# EAGLE design SpecialistEE20 (EAGLE 6.4)

## Sheet 1 of 5
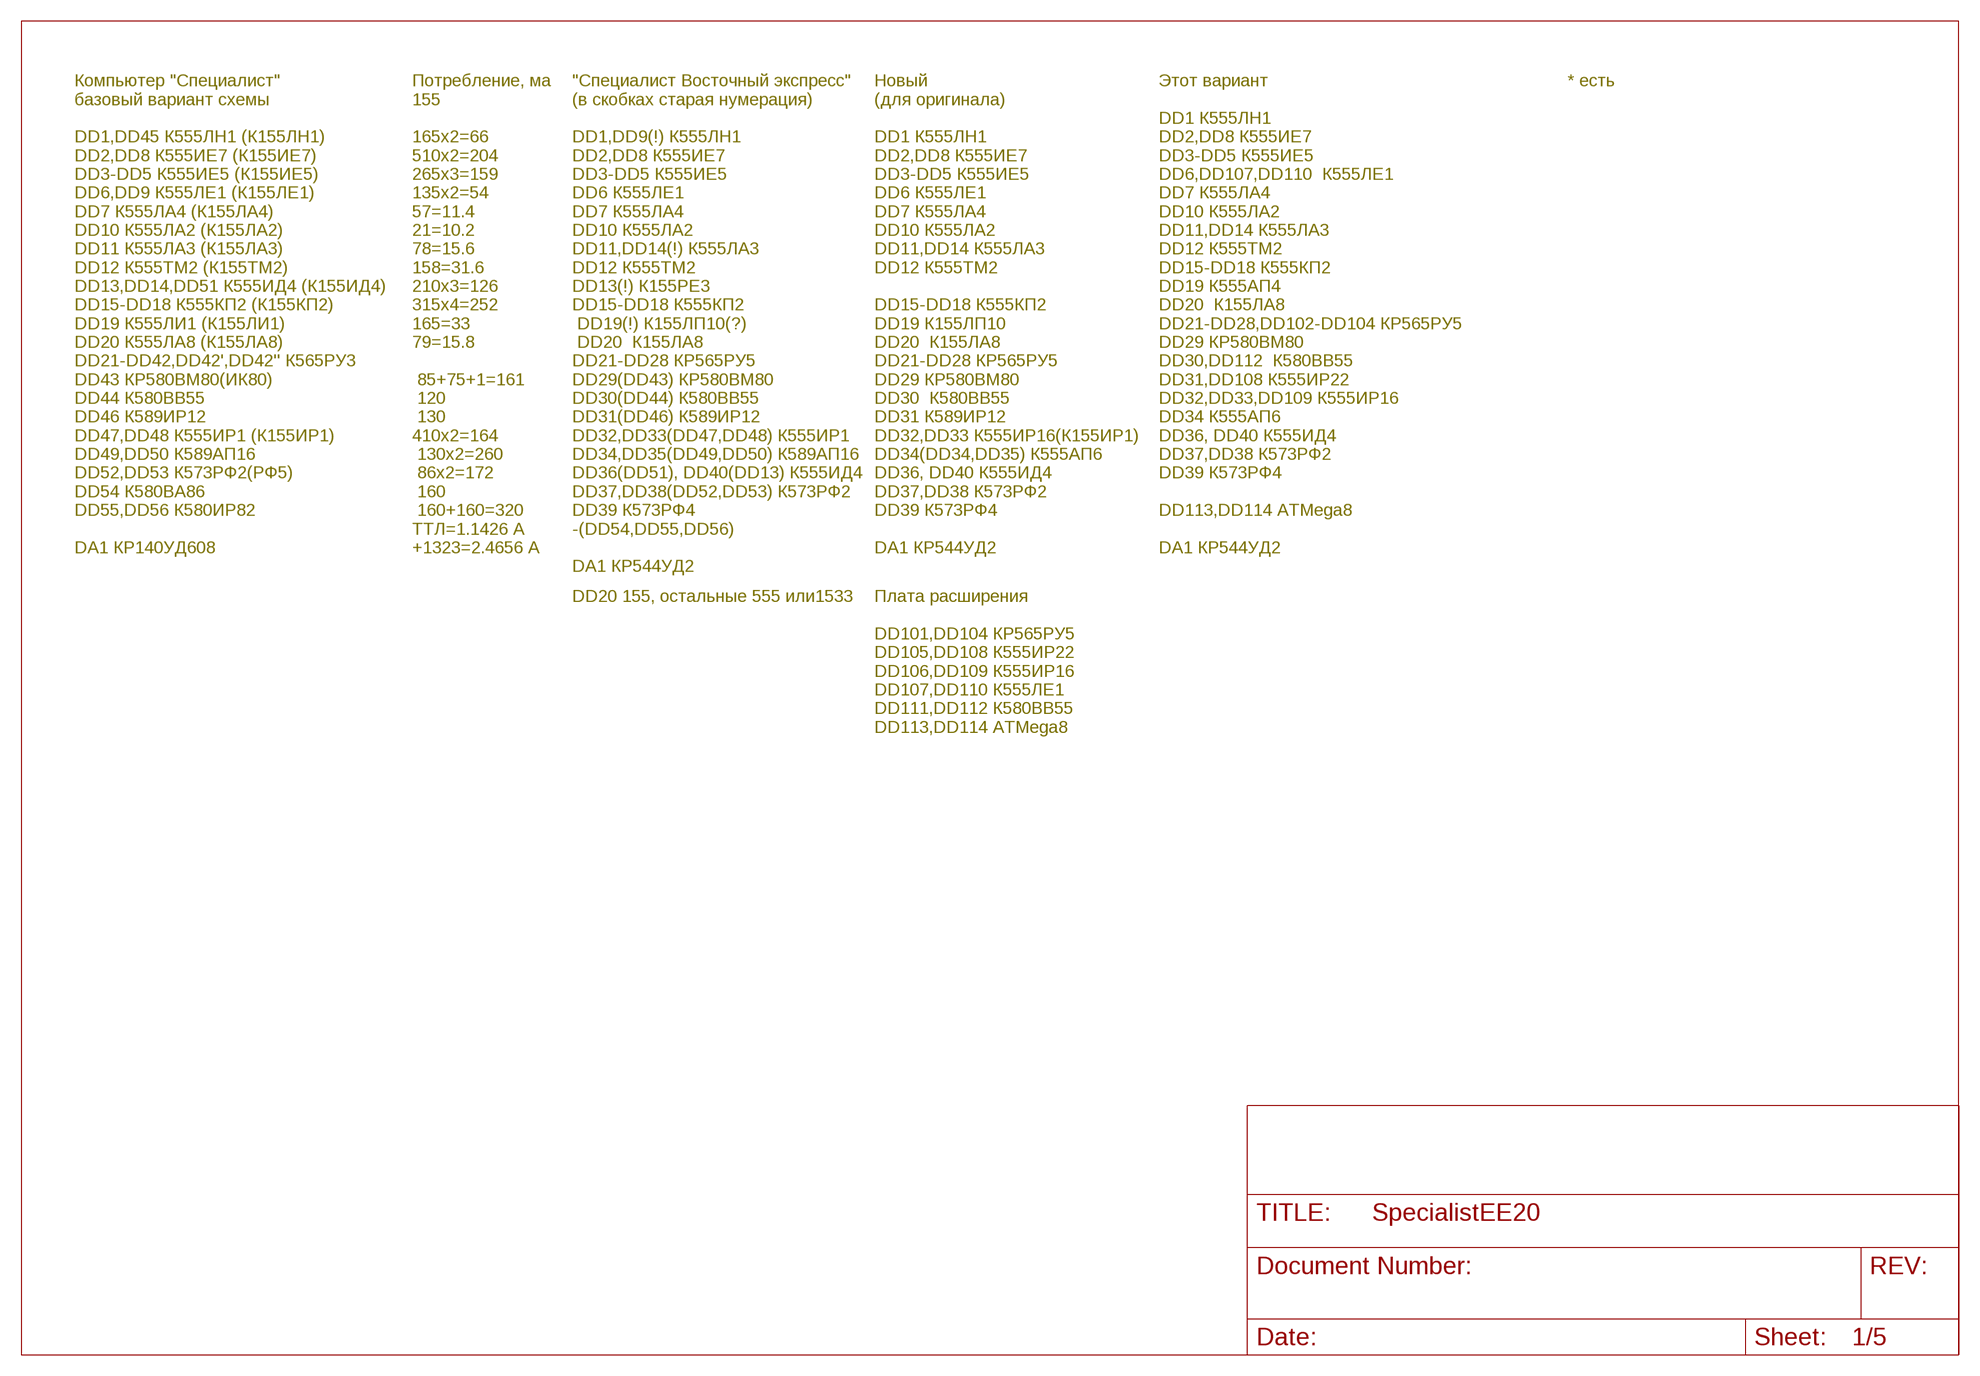
[diagram p0: schematic, sheet 1]

### Notes on the sheet
- Компьютер "Специалист"
  базовый вариант схемы
  
  DD1,DD45 К555ЛН1 (К155ЛН1)
  DD2,DD8 К555ИЕ7 (К155ИЕ7)
  DD3-DD5 К555ИЕ5 (К155ИЕ5)
  DD6,DD9 К555ЛЕ1 (К155ЛЕ1)
  DD7 К555ЛА4 (К155ЛА4)
  DD10 К555ЛА2 (К155ЛА2)
  DD11 К555ЛА3 (К155ЛА3)
  DD12 К555ТМ2 (К155ТМ2)
  DD13,DD14,DD51 К555ИД4 (К155ИД4)
  DD15-DD18 К555КП2 (К155КП2)
  DD19 К555ЛИ1 (К155ЛИ1)
  DD20 К555ЛА8 (К155ЛА8)
  DD21-DD42,DD42',DD42'' К565РУ3
  DD43 КР580ВМ80(ИК80)
  DD44 К580ВВ55
  DD46 К589ИР12
  DD47,DD48 К555ИР1 (К155ИР1)
  DD49,DD50 К589АП16
  DD52,DD53 К573РФ2(РФ5)
  DD54 К580ВА86
  DD55,DD56 К580ИР82
  
  DA1 КР140УД608
- Потребление, ма
  155 
  
  165х2=66
  510х2=204
  265х3=159
  135х2=54
  57=11.4
  21=10.2
  78=15.6
  158=31.6
  210х3=126
  315х4=252
  165=33
  79=15.8
  
   85+75+1=161
   120
   130
  410х2=164
   130х2=260
   86х2=172
   160
   160+160=320
  ТТЛ=1.1426 А
  +1323=2.4656 А
- "Специалист Восточный экспресс"
  (в скобках старая нумерация)
  
  DD1,DD9(!) К555ЛН1
  DD2,DD8 К555ИЕ7
  DD3-DD5 К555ИЕ5
  DD6 К555ЛЕ1
  DD7 К555ЛА4
  DD10 К555ЛА2
  DD11,DD14(!) К555ЛА3
  DD12 К555ТМ2
  DD13(!) К155РЕ3
  DD15-DD18 К555КП2
   DD19(!) К155ЛП10(?)
   DD20  К155ЛА8
  DD21-DD28 КР565РУ5
  DD29(DD43) КР580ВМ80
  DD30(DD44) К580ВВ55
  DD31(DD46) К589ИР12
  DD32,DD33(DD47,DD48) К555ИР1
  DD34,DD35(DD49,DD50) К589АП16
  DD36(DD51), DD40(DD13) К555ИД4 
  DD37,DD38(DD52,DD53) К573РФ2
  DD39 К573РФ4
  -(DD54,DD55,DD56)
  
  DA1 КР544УД2
- Новый
  (для оригинала)
  
  DD1 К555ЛН1
  DD2,DD8 К555ИЕ7
  DD3-DD5 К555ИЕ5
  DD6 К555ЛЕ1
  DD7 К555ЛА4
  DD10 К555ЛА2
  DD11,DD14 К555ЛА3
  DD12 К555ТМ2
  
  DD15-DD18 К555КП2
  DD19 К155ЛП10
  DD20  К155ЛА8
  DD21-DD28 КР565РУ5
  DD29 КР580ВМ80
  DD30  К580ВВ55
  DD31 К589ИР12
  DD32,DD33 К555ИР16(К155ИР1)
  DD34(DD34,DD35) К555АП6
  DD36, DD40 К555ИД4 
  DD37,DD38 К573РФ2
  DD39 К573РФ4
  
  DA1 КР544УД2
- Этот вариант
  
  DD1 К555ЛН1
  DD2,DD8 К555ИЕ7
  DD3-DD5 К555ИЕ5
  DD6,DD107,DD110  К555ЛЕ1
  DD7 К555ЛА4
  DD10 К555ЛА2
  DD11,DD14 К555ЛА3
  DD12 К555ТМ2
  DD15-DD18 К555КП2
  DD19 К555АП4
  DD20  К155ЛА8
  DD21-DD28,DD102-DD104 КР565РУ5
  DD29 КР580ВМ80
  DD30,DD112  К580ВВ55
  DD31,DD108 К555ИР22
  DD32,DD33,DD109 К555ИР16
  DD34 К555АП6
  DD36, DD40 К555ИД4 
  DD37,DD38 К573РФ2
  DD39 К573РФ4
  
  DD113,DD114 ATMega8
  
  DA1 КР544УД2
- * есть
- DD20 155, остальные 555 или1533
- Плата расширения
  
  DD101,DD104 КР565РУ5
  DD105,DD108 К555ИР22
  DD106,DD109 К555ИР16
  DD107,DD110 К555ЛЕ1
  DD111,DD112 К580ВВ55
  DD113,DD114 ATMega8

## Sheet 2 of 5
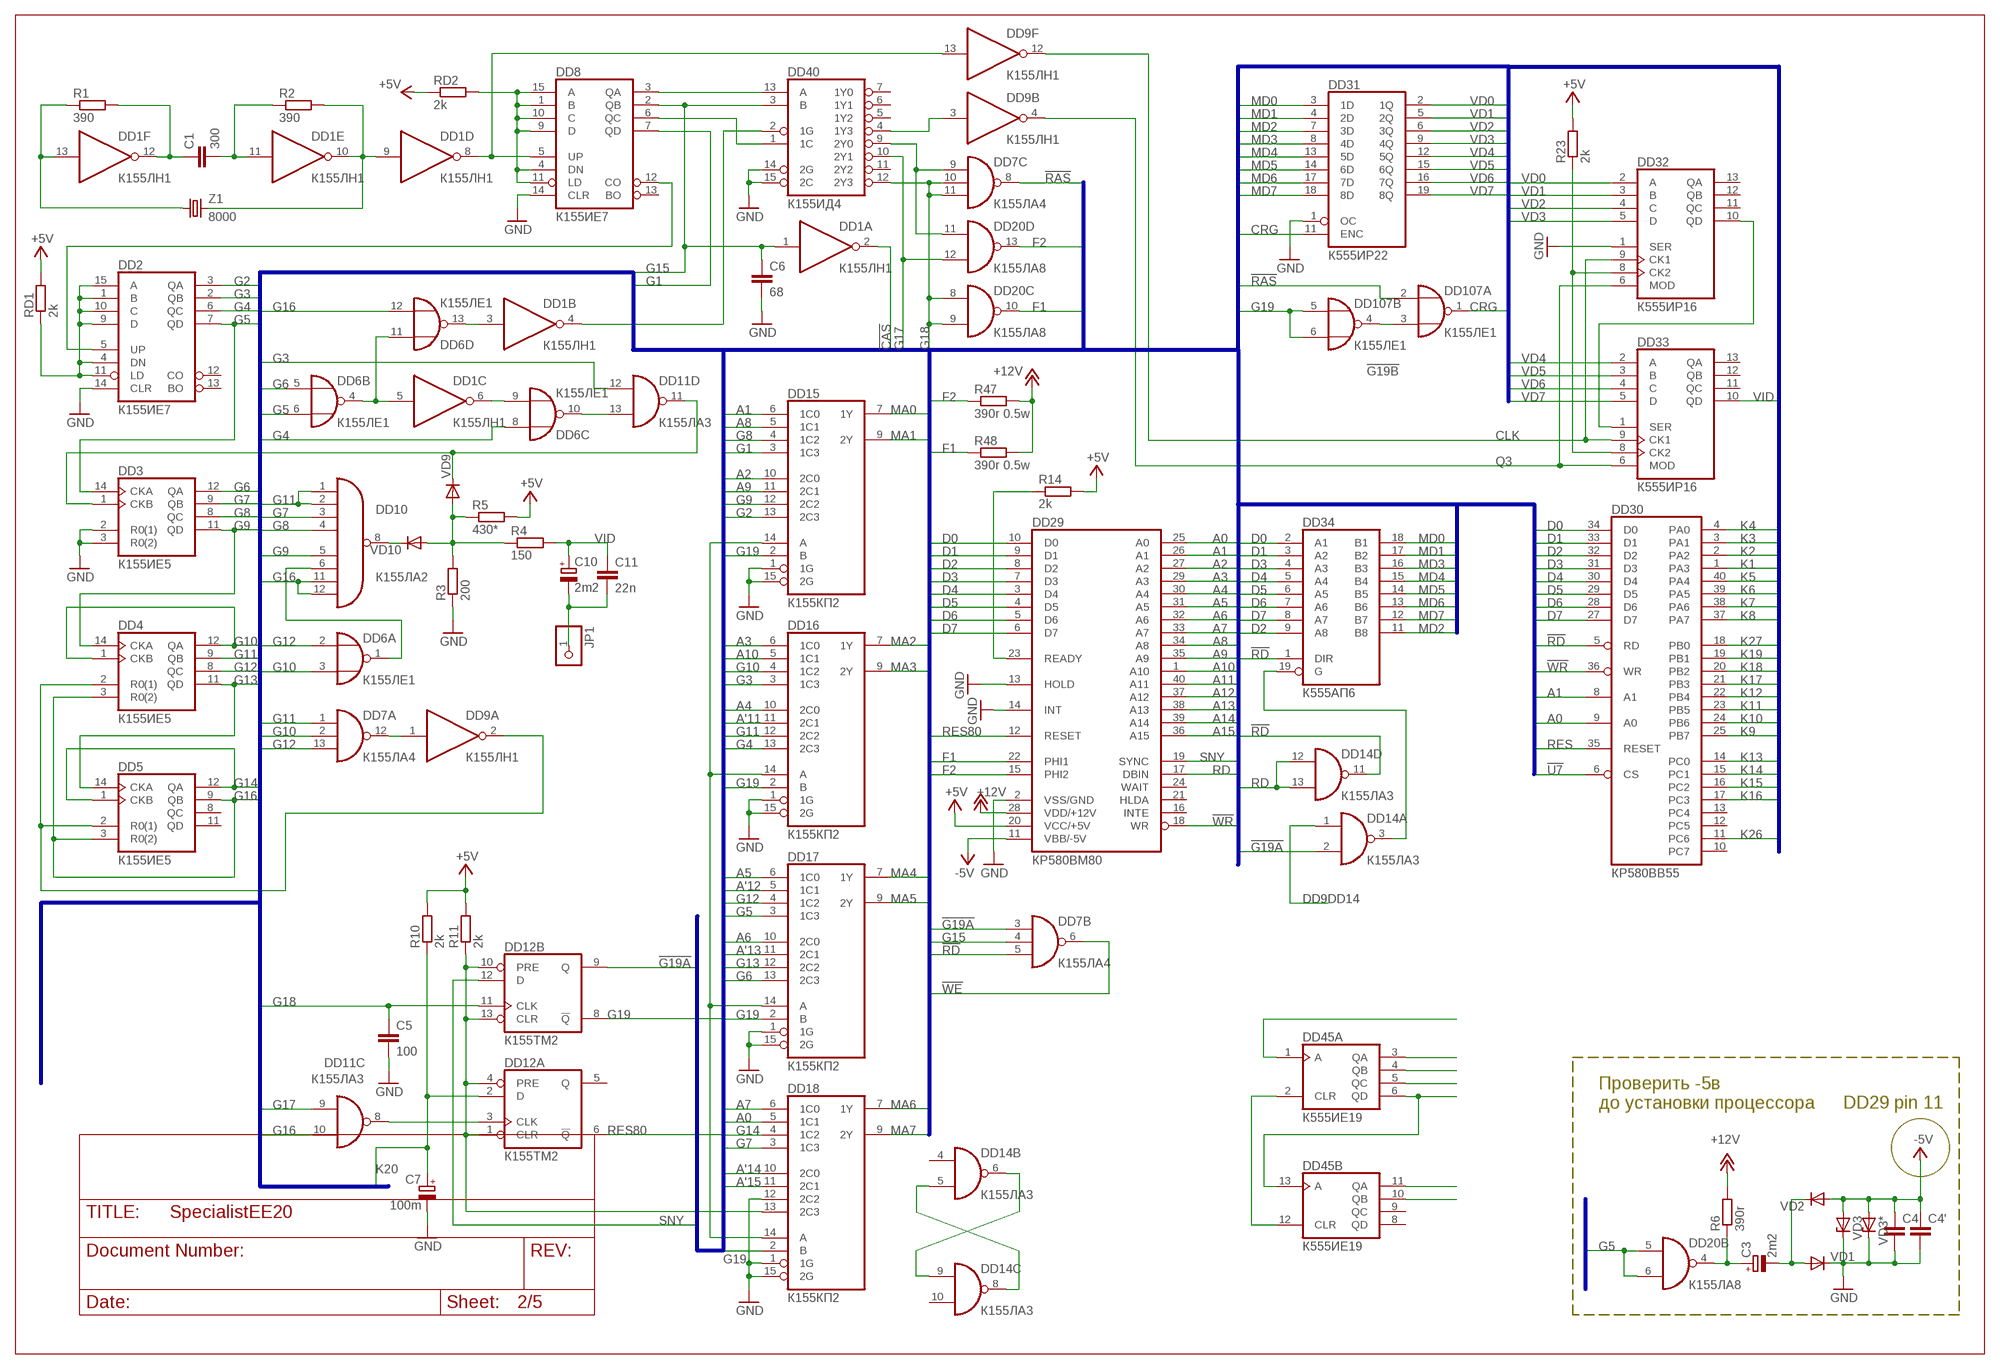
[diagram p1: schematic, sheet 2]

### Parts
C1  300  C-EUC0805  [C0805]
C3  2m2  CPOL-EUE2.5-5  [E2,5-5]
C4  C-EUC1206  [C1206]
C4'  C-EUC1206  [C1206]
C5  100  C-EUC0805  [C0805]
C6  68  C-EUC0805  [C0805]
C7  100m  CPOL-EUE2.5-5  [E2,5-5]
C10  2m2  CPOL-EUE2.5-5  [E2,5-5]
C11  22n  C-EUC0805  [C0805]
DD1  К155ЛН1  7404N  [DIL14]
DD2  К155ИЕ7  74192N  [DIL16]
DD3  К155ИЕ5  74LS93N  [DIL14]
DD4  К155ИЕ5  74LS93N  [DIL14]
DD5  К155ИЕ5  74LS93N  [DIL14]
DD6  К155ЛЕ1  7402N  [DIL14]
DD7  К155ЛА4  7410N  [DIL14]
DD8  К155ИЕ7  74192N  [DIL16]
DD9  К155ЛН1  7404N  [DIL14]
DD10  К155ЛА2  7430N  [DIL14]
DD11  К155ЛА3  7400N  [DIL14]
DD12  К155ТМ2  74S74N  [DIL14]
DD14  К155ЛА3  7400N  [DIL14]
DD15  К155КП2  74S153N  [DIL16]
DD16  К155КП2  74S153N  [DIL16]
DD17  К155КП2  74S153N  [DIL16]
DD18  К155КП2  74S153N  [DIL16]
DD20  К155ЛА8  74LS01N  [DIL14]
DD29  КР580ВМ80  8080  [DIL40]
DD30  КР580ВВ55  8255A  [DIL40]
DD31  К555ИР22  74LS373N  [DIL20]
DD32  К555ИР16  7495N  [DIL14]
DD33  К555ИР16  7495N  [DIL14]
DD34  К555АП6  74LS245N  [DIL20]
DD40  К155ИД4  74LS155N  [DIL16]
DD45  К555ИЕ19  74393N  [DIL14]
DD107  К155ЛЕ1  7402N  [DIL14]
JP1  PINHD-1X1  [1X01]
R1  390  R-EU_M1206  [M1206]
R2  390  R-EU_M1206  [M1206]
R3  200  R-EU_M1206  [M1206]
R4  150  R-EU_M1206  [M1206]
R5  430*  R-EU_M1206  [M1206]
R6  390r  R-EU_0411/15  [0411/15]
R10  2k  R-EU_M1206  [M1206]
R11  2k  R-EU_M1206  [M1206]
R14  2k  R-EU_M1206  [M1206]
R23  2k  R-EU_M1206  [M1206]
R47  390r 0.5w  R-EU_0411/15  [0411/15]
R48  390r 0.5w  R-EU_0411/15  [0411/15]
RD1  2k  R-EU_M1206  [M1206]
RD2  2k  R-EU_M1206  [M1206]
VD1  DIODE-SOD80C  [SOD80C]
VD2  DIODE-SOD80C  [SOD80C]
VD3  ZENER-DIODESOD80C  [SOD80C]
VD3*  ZENER-DIODESOD80C  [SOD80C]
VD9  DIODE-SOD80C  [SOD80C]
VD10  DIODE-SOD80C  [SOD80C]
Z1  8000  CRYSTALHC49S  [HC49/S]

### Nets
!CAS: DD1.2(A:O) ; also sheet 3,4
!G19A: DD7.3(B:I0) DD12.9(B:Q) DD14.2(A:I1)
!G19B: DD107.3(A:I1) DD107.4(B:O)
!RAS: DD7.8(C:O) DD107.2(A:I0) ; also sheet 3,4
!RD: DD7.5(B:I2) DD14.11(D:O) DD30.5(RD) DD34.1(DIR) ; also sheet 5
!U7: DD30.6(CS) ; also sheet 5
!WE: DD7.6(B:O) ; also sheet 3,4
!WR: DD29.18(WR) DD30.36(WR) ; also sheet 5
+5V: DD29.20(VCC/+5V) R5.2 R10.2 R11.2 R14.2 R23.2 RD1.2 RD2.1 ; also sheet 3,4,5
+12V: DD29.28(VDD/+12V) R6.2 R47.2 R48.2 ; also sheet 3
-5V: C4'.1 C4.1 DD29.11(VBB/-5V) VD2.A VD3*.A VD3.A
A0: DD18.5(1C1) DD29.25(A0) DD30.9(A0) ; also sheet 5
A1: DD15.6(1C0) DD29.26(A1) DD30.8(A1) ; also sheet 5
A2: DD15.10(2C0) DD29.27(A2)
A3: DD16.6(1C0) DD29.29(A3)
A4: DD16.10(2C0) DD29.30(A4)
A5: DD17.6(1C0) DD29.31(A5)
A6: DD17.10(2C0) DD29.32(A6)
A7: DD18.6(1C0) DD29.33(A7)
A8: DD15.5(1C1) DD29.34(A8)
A9: DD15.11(2C1) DD29.35(A9)
A10: DD16.5(1C1) DD29.1(A10)
A11: DD29.40(A11) ; also sheet 3
A12: DD29.37(A12) ; also sheet 3
A13: DD29.38(A13) ; also sheet 3
A14: DD29.39(A14) ; also sheet 3
A15: DD29.36(A15) ; also sheet 3
A'11: DD16.11(2C1)
A'12: DD17.5(1C1)
A'13: DD17.11(2C1)
A'14: DD18.10(2C0)
A'15: DD18.11(2C1)
CLK: DD9.12(F:O) DD32.9(CK1) DD33.9(CK1) ; also sheet 4
CRG: DD31.11(ENC) DD107.1(A:O) ; also sheet 4
D0: DD29.10(D0) DD30.34(D0) DD34.2(A1) ; also sheet 5
D1: DD29.9(D1) DD30.33(D1) DD34.3(A2) ; also sheet 5
D2: DD29.8(D2) DD30.32(D2) DD34.9(A8) ; also sheet 5
D3: DD29.7(D3) DD30.31(D3) DD34.4(A3) ; also sheet 5
D4: DD29.3(D4) DD30.30(D4) DD34.5(A4) ; also sheet 5
D5: DD29.4(D5) DD30.29(D5) DD34.6(A5) ; also sheet 5
D6: DD29.5(D6) DD30.28(D6) DD34.7(A6) ; also sheet 5
D7: DD29.6(D7) DD30.27(D7) DD34.8(A7) ; also sheet 5
DD9DD14: DD14.1(A:I0) ; also sheet 3
F1: DD20.10(C:O) DD29.22(PHI1) R48.1
F2: DD20.13(D:O) DD29.15(PHI2) R47.1
G1: DD8.7(QD) DD15.3(1C3)
G2: DD2.3(QA) DD15.13(2C3)
G3: DD2.2(QB) DD11.12(D:I0) DD16.3(1C3)
G4: DD2.6(QC) DD6.8(C:I0) DD16.13(2C3)
G5: DD2.7(QD) DD3.14(CKA) DD6.6(B:I1) DD17.3(1C3) DD20.5(B:I0) DD20.6(B:I1)
G6: DD3.12(QA) DD6.5(B:I0) DD17.13(2C3)
G7: DD3.9(QB) DD10.3(I2) DD18.3(1C3)
G8: DD3.8(QC) DD10.4(I3) DD15.4(1C2)
G9: DD3.11(QD) DD4.14(CKA) DD10.5(I4) DD15.12(2C2)
G10: DD4.1(CKB) DD4.12(QA) DD6.3(A:I1) DD7.2(A:I1) DD16.4(1C2)
G11: DD4.9(QB) DD7.1(A:I0) DD10.1(I0) DD10.2(I1) DD16.12(2C2)
G12: DD4.8(QC) DD6.2(A:I0) DD7.13(A:I2) DD17.4(1C2)
G13: DD4.11(QD) DD5.14(CKA) DD17.12(2C2)
G14: DD5.1(CKB) DD5.12(QA) DD18.4(1C2)
G15: C6.1 DD1.1(A:I) DD7.4(B:I1) DD8.2(QB) DD40.3(B)
G16: DD4.3(R0(2)) DD5.3(R0(2)) DD5.9(QB) DD6.12(D:I1) DD10.11(I6) DD10.12(I7) DD11.10(C:I1)
G17: DD11.9(C:I0) DD20.12(D:I1) DD40.10(2Y1)
G18: C5.1 DD7.10(C:I1) DD7.11(C:I2) DD12.11(B:CLK) DD20.8(C:I0) DD20.9(C:I1) DD40.12(2Y3)
G19: DD12.8(B:!Q) DD15.2(B) DD16.2(B) DD17.2(B) DD18.2(B) DD107.5(B:I0) DD107.6(B:I1)
GND: C4'.2 C4.2 C5.2 C6.2 C7.- DD2.14(CLR) DD3.2(R0(1)) DD3.3(R0(2)) DD8.14(CLR) DD15.1(1G) DD15.15(2G) DD16.1(1G) DD16.15(2G) DD17.1(1G) DD17.15(2G) DD18.1(1G) DD18.12(2C2) DD18.15(2G) DD29.2(VSS/GND) DD29.13(HOLD) DD29.14(INT) DD31.1(OC) DD32.1(SER) DD40.14(2G) DD40.15(2C) R3.1 VD1.C VD3*.C VD3.C ; also sheet 3,4,5
K1: DD30.1(PA3) ; also sheet 5
K2: DD30.2(PA2) ; also sheet 5
K3: DD30.3(PA1) ; also sheet 5
K4: DD30.4(PA0) ; also sheet 5
K5: DD30.40(PA4) ; also sheet 5
K6: DD30.39(PA5) ; also sheet 5
K7: DD30.38(PA6) ; also sheet 5
K8: DD30.37(PA7) ; also sheet 5
K9: DD30.25(PB7) ; also sheet 5
K10: DD30.24(PB6) ; also sheet 5
K11: DD30.23(PB5) ; also sheet 5
K12: DD30.22(PB4) ; also sheet 5
K13: DD30.14(PC0) ; also sheet 5
K14: DD30.15(PC1) ; also sheet 5
K15: DD30.16(PC2) ; also sheet 5
K16: DD30.17(PC3) ; also sheet 5
K17: DD30.21(PB3) ; also sheet 5
K18: DD30.20(PB2) ; also sheet 5
K19: DD30.19(PB1) ; also sheet 5
K20: C7.+ DD12.2(A:D) R10.1
K26: DD30.11(PC6)
K27: DD30.18(PB0) ; also sheet 5
MA0: DD15.7(1Y) ; also sheet 3,4
MA1: DD15.9(2Y) ; also sheet 3,4
MA2: DD16.7(1Y) ; also sheet 3,4
MA3: DD16.9(2Y) ; also sheet 3,4
MA4: DD17.7(1Y) ; also sheet 3,4
MA5: DD17.9(2Y) ; also sheet 3,4
MA6: DD18.7(1Y) ; also sheet 3,4
MA7: DD18.9(2Y) ; also sheet 3,4
MD0: DD31.3(1D) DD34.18(B1) ; also sheet 3
MD1: DD31.4(2D) DD34.17(B2) ; also sheet 3
MD2: DD31.7(3D) DD34.11(B8) ; also sheet 3
MD3: DD31.8(4D) DD34.16(B3) ; also sheet 3
MD4: DD31.13(5D) DD34.15(B4) ; also sheet 3
MD5: DD31.14(6D) DD34.14(B5) ; also sheet 3
MD6: DD31.17(7D) DD34.13(B6) ; also sheet 3
MD7: DD31.18(8D) DD34.12(B7) ; also sheet 3
N$1: DD6.10(C:O) DD11.13(D:I1)
N$2: DD1.5(C:I) DD6.4(B:O) DD6.11(D:I0)
N$3: DD1.13(F:I) R1.1 Z1.1
N$4: DD9.3(B:I) DD40.4(1Y3)
N$5: C1.1 DD1.12(F:O) R1.2
N$6: DD1.9(D:I) DD1.10(E:O) R2.2 Z1.2
N$7: C1.2 DD1.11(E:I) R2.1
N$8: DD1.8(D:O) DD8.5(UP) DD9.13(F:I)
N$11: DD2.5(UP) DD8.12(CO)
N$12: DD6.1(A:O) DD10.6(I5)
N$13: DD1.6(C:O) DD6.9(C:I1)
N$14: DD1.3(B:I) DD6.13(D:O)
N$16: DD4.2(R0(1)) DD5.2(R0(1)) DD9.2(A:O)
N$19: DD7.9(C:I0) DD20.11(D:I0) DD40.9(2Y0)
N$20: DD8.3(QA) DD40.13(A)
N$21: C3.+ DD20.4(B:O) R6.1
N$22: C3.- VD1.A VD2.C
N$23: DD8.6(QC) DD40.1(1C)
N$24: DD1.4(B:O) DD40.2(1G)
N$25: DD10.8(O) VD10.C
N$26: DD3.1(CKB) DD11.11(D:O) VD9.C
N$27: R3.2 R4.1 R5.1 VD9.A VD10.A
N$28: DD32.10(QD) DD33.1(SER)
N$29: DD2.1(B) DD2.4(DN) DD2.9(D) DD2.10(C) DD2.11(LD) DD2.15(A) RD1.1
N$30: DD45.3(A:QA)
N$31: DD12.1(A:CLR) DD12.4(A:PRE) DD12.10(B:PRE) DD12.13(B:CLR) DD18.13(2C3) R11.1
N$32: DD45.6(A:QD) DD45.13(B:A)
N$33: C10.- C11.2 JP1.1
N$34: DD11.8(C:O) DD12.3(A:CLK)
N$36: DD14.5(B:I1) DD14.8(C:O)
N$37: DD7.12(A:O) DD9.1(A:I)
N$38: DD8.1(B) DD8.4(DN) DD8.9(D) DD8.10(C) DD8.11(LD) DD8.15(A) RD2.2
N$41: DD15.14(A) DD16.14(A) DD17.14(A) DD18.14(A)
N$47: DD45.4(A:QB)
N$49: DD32.8(CK2) DD33.8(CK2) R23.1
N$57: DD14.6(B:O) DD14.9(C:I0)
N$61: DD45.5(A:QC)
N$62: DD45.11(B:QA)
N$63: DD45.10(B:QB)
N$64: DD45.1(A:A)
N$65: DD45.2(A:CLR) DD45.12(B:CLR)
N$66: DD29.23(READY) R14.1
N$69: DD14.3(A:O) DD34.19(G)
Q3: DD9.4(B:O) DD32.6(MOD) DD33.6(MOD) ; also sheet 4
RD: DD14.12(D:I0) DD14.13(D:I1) DD29.17(DBIN)
RES: DD30.35(RESET) ; also sheet 5
RES80: DD12.6(A:!Q) DD29.12(RESET)
SNY: DD12.12(B:D) DD29.19(SYNC)
VD0: DD31.2(1Q) DD32.2(A)
VD1: DD31.5(2Q) DD32.3(B)
VD2: DD31.6(3Q) DD32.4(C)
VD3: DD31.9(4Q) DD32.5(D)
VD4: DD31.12(5Q) DD33.2(A)
VD5: DD31.15(6Q) DD33.3(B)
VD6: DD31.16(7Q) DD33.4(C)
VD7: DD31.19(8Q) DD33.5(D)
VID: C10.+ C11.1 DD33.10(QD) R4.2 ; also sheet 4
Unconnected: DD2.12(CO) DD2.13(BO) DD5.8(QC) DD5.11(QD) DD8.13(BO) DD9.8(D:O) DD9.9(D:I) DD9.10(E:O) DD9.11(E:I) DD11.4(B:I0) DD11.5(B:I1) DD11.6(B:O) DD12.5(A:Q) DD14.4(B:I0) DD14.10(C:I1) DD29.16(INTE) DD29.21(HLDA) DD29.24(WAIT) DD30.10(PC7) DD30.12(PC5) DD30.13(PC4) DD32.11(QC) DD32.12(QB) DD32.13(QA) DD33.11(QC) DD33.12(QB) DD33.13(QA) DD40.5(1Y2) DD40.6(1Y1) DD40.7(1Y0) DD40.11(2Y2) DD45.8(B:QD) DD45.9(B:QC)

### Buses
A[0..15],A'[11..15],D[0..7],F[1..2],G[1..19],!G19A,MA[0..7],MD[0..7],VD[0..11],K[1..27],!RAS,!CAS,CLK,!WE,!WR,X-----X,U7,!U[6..7],!RESIN,RES,RES80,RD,!RD,SNY,STRT,B,G,R,B0,G0,R0,SND,VID,LED,P[1..24],R[1..2],CRG,CS,!R,SH,TON,Q3,MOSI,MISO,SCK

### Notes on the sheet
- Проверить -5в 
  до установки процессора
- DD29 pin 11

## Sheet 3 of 5
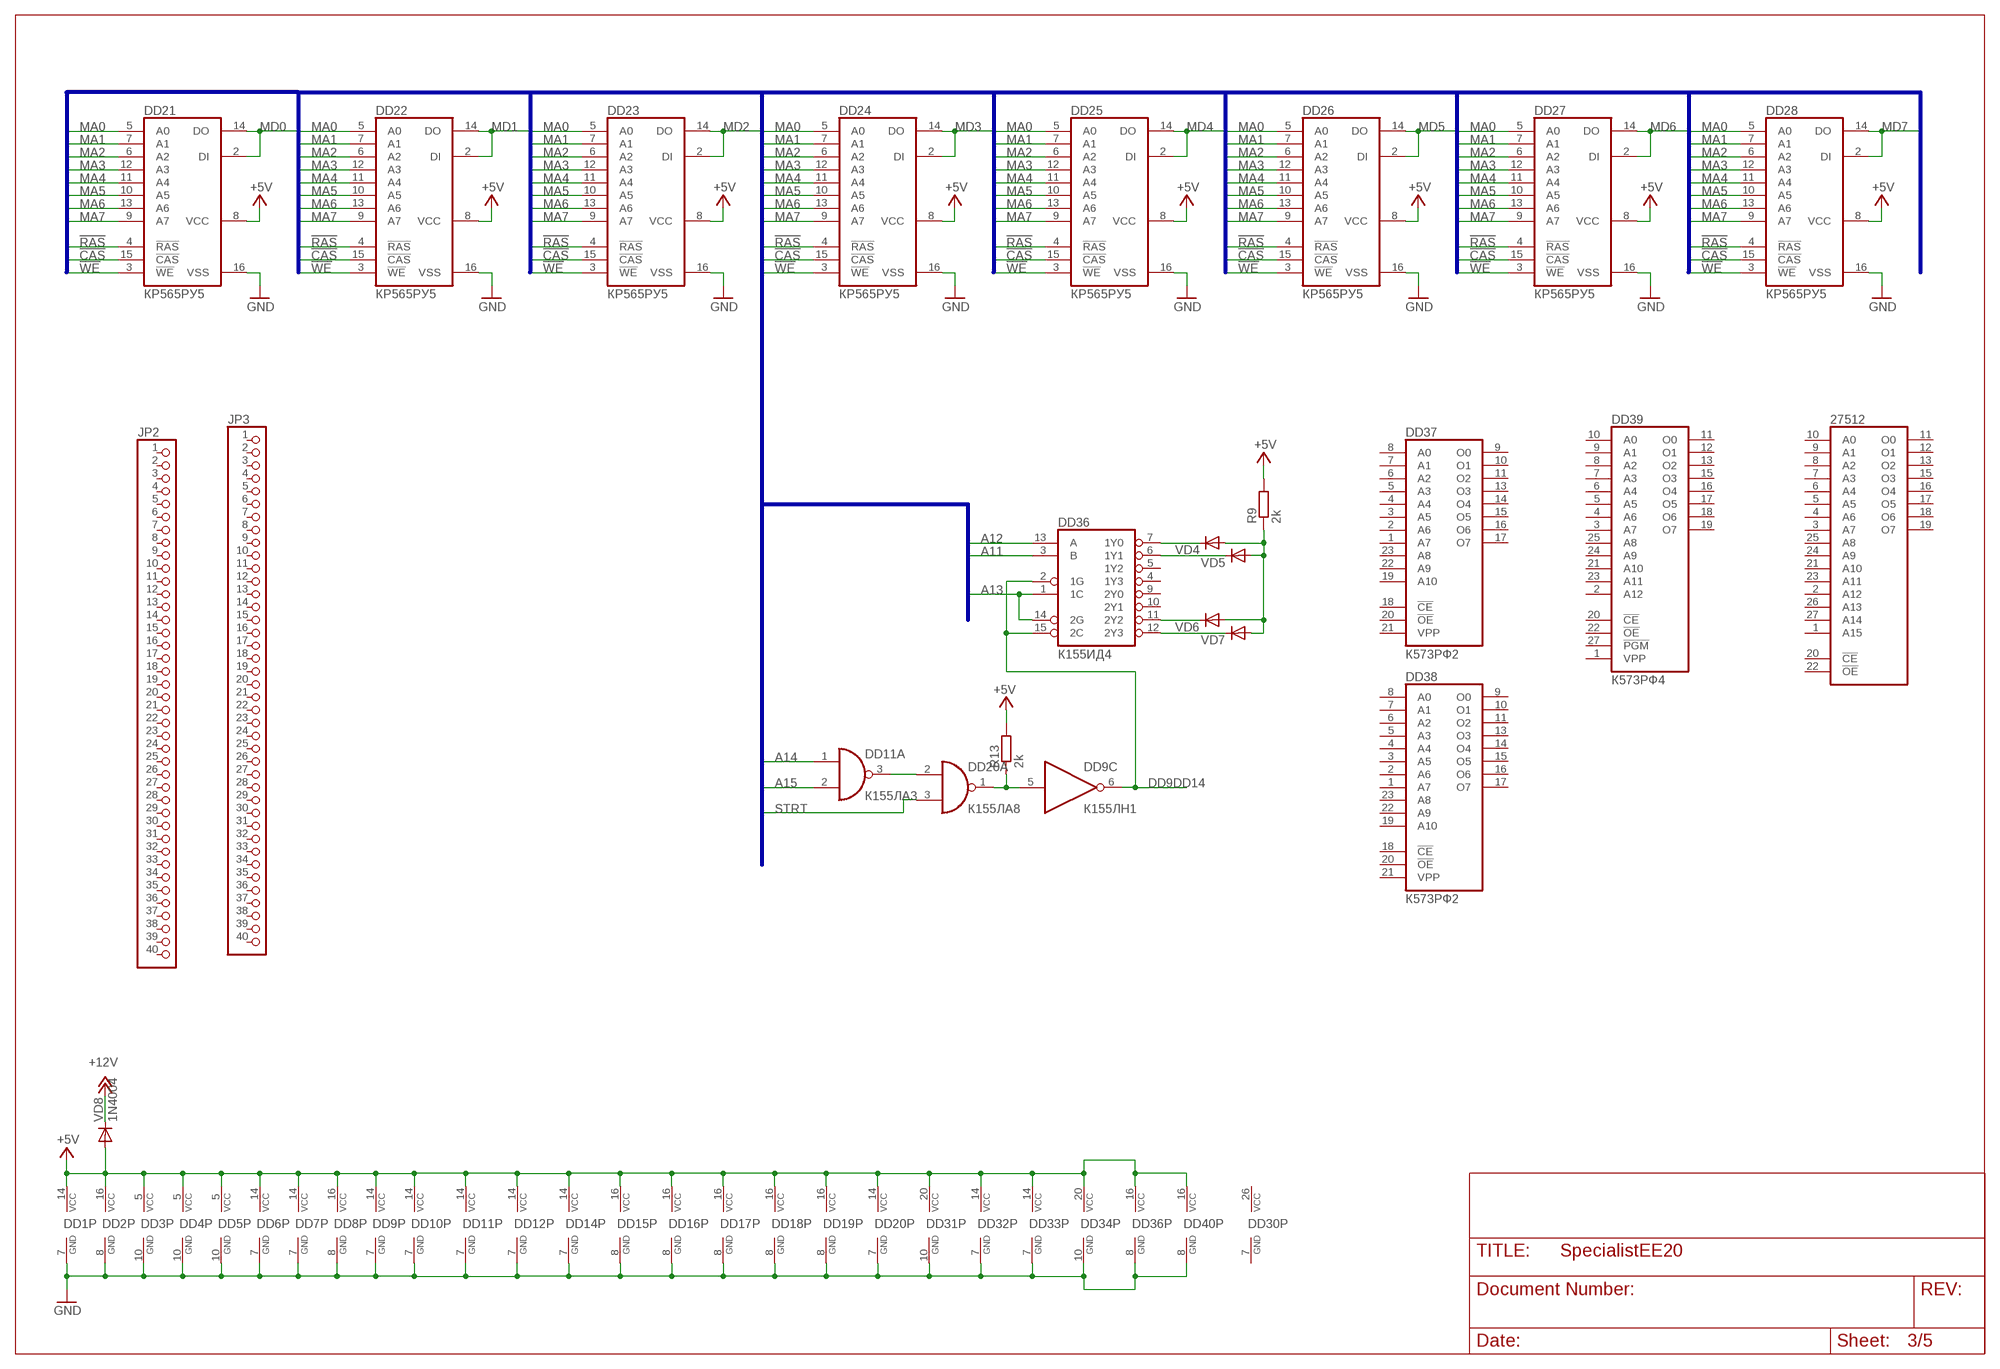
[diagram p2: schematic, sheet 3]

### Parts
27512  27512  [DIL28]
DD19  К155ЛП10  74LS365N  [DIL16]
DD21  КР565РУ5  2164  [DIL16]
DD22  КР565РУ5  2164  [DIL16]
DD23  КР565РУ5  2164  [DIL16]
DD24  КР565РУ5  2164  [DIL16]
DD25  КР565РУ5  2164  [DIL16]
DD26  КР565РУ5  2164  [DIL16]
DD27  КР565РУ5  2164  [DIL16]
DD28  КР565РУ5  2164  [DIL16]
DD36  К155ИД4  74LS155N  [DIL16]
DD37  К573РФ2  2716  [DIL24]
DD38  К573РФ2  2716  [DIL24]
DD39  К573РФ4  2764  [DIL28]
JP2  PINHD-1X40  [1X40]
JP3  PINHD-1X40  [1X40]
R9  2k  R-EU_M1206  [M1206]
R13  2k  R-EU_M1206  [M1206]
VD4  DIODE-SOD80C  [SOD80C]
VD5  DIODE-SOD80C  [SOD80C]
VD6  DIODE-SOD80C  [SOD80C]
VD7  DIODE-SOD80C  [SOD80C]
VD8  1N4004  [DO41-10]

### Nets
!CAS: DD21.15(!CAS) DD22.15(!CAS) DD23.15(!CAS) DD24.15(!CAS) DD25.15(!CAS) DD26.15(!CAS) DD27.15(!CAS) DD28.15(!CAS) ; also sheet 2,4
!RAS: DD21.4(!RAS) DD22.4(!RAS) DD23.4(!RAS) DD24.4(!RAS) DD25.4(!RAS) DD26.4(!RAS) DD27.4(!RAS) DD28.4(!RAS) ; also sheet 2,4
!WE: DD21.3(!WE) DD22.3(!WE) DD23.3(!WE) DD24.3(!WE) DD25.3(!WE) DD26.3(!WE) DD27.3(!WE) DD28.3(!WE) ; also sheet 2,4
+5V: DD1.14(P:VCC) DD2.16(VCC) DD3.5(VCC) DD4.5(VCC) DD5.5(VCC) DD6.14(P:VCC) DD7.14(P:VCC) DD8.16(VCC) DD9.14(P:VCC) DD10.14(VCC) DD11.14(P:VCC) DD12.14(P:VCC) DD14.14(P:VCC) DD15.16(VCC) DD16.16(VCC) DD17.16(VCC) DD18.16(VCC) DD19.16(VCC) DD20.14(P:VCC) DD21.8(VCC) DD22.8(VCC) DD23.8(VCC) DD24.8(VCC) DD25.8(VCC) DD26.8(VCC) DD27.8(VCC) DD28.8(VCC) DD31.20(VCC) DD32.14(VCC) DD33.14(VCC) DD34.20(VCC) DD36.16(VCC) DD40.16(VCC) R9.2 R13.2 VD8.A ; also sheet 2,4,5
+12V: VD8.C ; also sheet 2
A11: DD36.3(B) ; also sheet 2
A12: DD36.13(A) ; also sheet 2
A13: DD36.1(1C) DD36.14(2G) ; also sheet 2
A14: DD11.1(A:I0) ; also sheet 2
A15: DD11.2(A:I1) ; also sheet 2
DD9DD14: DD9.6(C:O) DD36.2(1G) DD36.15(2C) ; also sheet 2
GND: DD1.7(P:GND) DD2.8(GND) DD3.10(GND) DD4.10(GND) DD5.10(GND) DD6.7(P:GND) DD7.7(P:GND) DD8.8(GND) DD9.7(P:GND) DD10.7(GND) DD11.7(P:GND) DD12.7(P:GND) DD14.7(P:GND) DD15.8(GND) DD16.8(GND) DD17.8(GND) DD18.8(GND) DD19.8(GND) DD20.7(P:GND) DD21.16(VSS) DD22.16(VSS) DD23.16(VSS) DD24.16(VSS) DD25.16(VSS) DD26.16(VSS) DD27.16(VSS) DD28.16(VSS) DD31.10(GND) DD32.7(GND) DD33.7(GND) DD34.10(GND) DD36.8(GND) DD40.8(GND) ; also sheet 2,4,5
MA0: DD21.5(A0) DD22.5(A0) DD23.5(A0) DD24.5(A0) DD25.5(A0) DD26.5(A0) DD27.5(A0) DD28.5(A0) ; also sheet 2,4
MA1: DD21.7(A1) DD22.7(A1) DD23.7(A1) DD24.7(A1) DD25.7(A1) DD26.7(A1) DD27.7(A1) DD28.7(A1) ; also sheet 2,4
MA2: DD21.6(A2) DD22.6(A2) DD23.6(A2) DD24.6(A2) DD25.6(A2) DD26.6(A2) DD27.6(A2) DD28.6(A2) ; also sheet 2,4
MA3: DD21.12(A3) DD22.12(A3) DD23.12(A3) DD24.12(A3) DD25.12(A3) DD26.12(A3) DD27.12(A3) DD28.12(A3) ; also sheet 2,4
MA4: DD21.11(A4) DD22.11(A4) DD23.11(A4) DD24.11(A4) DD25.11(A4) DD26.11(A4) DD27.11(A4) DD28.11(A4) ; also sheet 2,4
MA5: DD21.10(A5) DD22.10(A5) DD23.10(A5) DD24.10(A5) DD25.10(A5) DD26.10(A5) DD27.10(A5) DD28.10(A5) ; also sheet 2,4
MA6: DD21.13(A6) DD22.13(A6) DD23.13(A6) DD24.13(A6) DD25.13(A6) DD26.13(A6) DD27.13(A6) DD28.13(A6) ; also sheet 2,4
MA7: DD21.9(A7) DD22.9(A7) DD23.9(A7) DD24.9(A7) DD25.9(A7) DD26.9(A7) DD27.9(A7) DD28.9(A7) ; also sheet 2,4
MD0: DD21.2(DI) DD21.14(DO) ; also sheet 2
MD1: DD22.2(DI) DD22.14(DO) ; also sheet 2
MD2: DD23.2(DI) DD23.14(DO) ; also sheet 2
MD3: DD24.2(DI) DD24.14(DO) ; also sheet 2
MD4: DD25.2(DI) DD25.14(DO) ; also sheet 2
MD5: DD26.2(DI) DD26.14(DO) ; also sheet 2
MD6: DD27.2(DI) DD27.14(DO) ; also sheet 2
MD7: DD28.2(DI) DD28.14(DO) ; also sheet 2
N$9: DD36.7(1Y0) VD4.C
N$10: DD36.6(1Y1) VD5.C
N$15: DD36.11(2Y2) VD6.C
N$17: DD36.12(2Y3) VD7.C
N$18: R9.1 VD4.A VD5.A VD6.A VD7.A
N$44: DD11.3(A:O) DD20.2(A:I0)
N$53: DD9.5(C:I) DD20.1(A:O) R13.1
STRT: DD20.3(A:I1)
Unconnected: 27512.1(A15) 27512.2(A12) 27512.3(A7) 27512.4(A6) 27512.5(A5) 27512.6(A4) 27512.7(A3) 27512.8(A2) 27512.9(A1) 27512.10(A0) 27512.11(O0) 27512.12(O1) 27512.13(O2) 27512.15(O3) 27512.16(O4) 27512.17(O5) 27512.18(O6) 27512.19(O7) 27512.20(!CE) 27512.21(A10) 27512.22(!OE) 27512.23(A11) 27512.24(A9) 27512.25(A8) 27512.26(A13) 27512.27(A14) DD19.1(G1) DD19.2(A1) DD19.3(Y1) DD19.4(A2) DD19.5(Y2) DD19.6(A3) DD19.7(Y3) DD19.9(Y4) DD19.10(A4) DD19.11(Y5) DD19.12(A5) DD19.13(Y6) DD19.14(A6) DD19.15(G2) DD36.4(1Y3) DD36.5(1Y2) DD36.9(2Y0) DD36.10(2Y1) DD37.1(A7) DD37.2(A6) DD37.3(A5) DD37.4(A4) DD37.5(A3) DD37.6(A2) DD37.7(A1) DD37.8(A0) DD37.9(O0) DD37.10(O1) DD37.11(O2) DD37.13(O3) DD37.14(O4) DD37.15(O5) DD37.16(O6) DD37.17(O7) DD37.18(!CE) DD37.19(A10) DD37.20(!OE) DD37.21(VPP) DD37.22(A9) DD37.23(A8) DD38.1(A7) DD38.2(A6) DD38.3(A5) DD38.4(A4) DD38.5(A3) DD38.6(A2) DD38.7(A1) DD38.8(A0) DD38.9(O0) DD38.10(O1) DD38.11(O2) DD38.13(O3) DD38.14(O4) DD38.15(O5) DD38.16(O6) DD38.17(O7) DD38.18(!CE) DD38.19(A10) DD38.20(!OE) DD38.21(VPP) DD38.22(A9) DD38.23(A8) DD39.1(VPP) DD39.2(A12) DD39.3(A7) DD39.4(A6) DD39.5(A5) DD39.6(A4) DD39.7(A3) DD39.8(A2) DD39.9(A1) DD39.10(A0) DD39.11(O0) DD39.12(O1) DD39.13(O2) DD39.15(O3) DD39.16(O4) DD39.17(O5) DD39.18(O6) DD39.19(O7) DD39.20(!CE) DD39.21(A10) DD39.22(!OE) DD39.23(A11) DD39.24(A9) DD39.25(A8) DD39.27(!PGM) JP2.1 JP2.2 JP2.3 JP2.4 JP2.5 JP2.6 JP2.7 JP2.8 JP2.9 JP2.10 JP2.11 JP2.12 JP2.13 JP2.14 JP2.15 JP2.16 JP2.17 JP2.18 JP2.19 JP2.20 JP2.21 JP2.22 JP2.23 JP2.24 JP2.25 JP2.26 JP2.27 JP2.28 JP2.29 JP2.30 JP2.31 JP2.32 JP2.33 JP2.34 JP2.35 JP2.36 JP2.37 JP2.38 JP2.39 JP2.40 JP3.1 JP3.2 JP3.3 JP3.4 JP3.5 JP3.6 JP3.7 JP3.8 JP3.9 JP3.10 JP3.11 JP3.12 JP3.13 JP3.14 JP3.15 JP3.16 JP3.17 JP3.18 JP3.19 JP3.20 JP3.21 JP3.22 JP3.23 JP3.24 JP3.25 JP3.26 JP3.27 JP3.28 JP3.29 JP3.30 JP3.31 JP3.32 JP3.33 JP3.34 JP3.35 JP3.36 JP3.37 JP3.38 JP3.39 JP3.40

### Buses
A[0..15],A'[11..15],D[0..7],F[1..2],G[1..19],!G19A,MA[0..7],MD[0..7],VD[0..11],K[1..27],!RAS,!CAS,CLK,!WE,!WR,X-----X,U7,!U[6..7],!RESIN,RES,RES80,RD,!RD,SNY,STRT,B,G,R,B0,G0,R0,SND,VID,LED,P[1..24],R[1..2],CRG,CS,!R,SH,TON,Q3,MOSI,MISO,SCK

## Sheet 4 of 5: VCOL
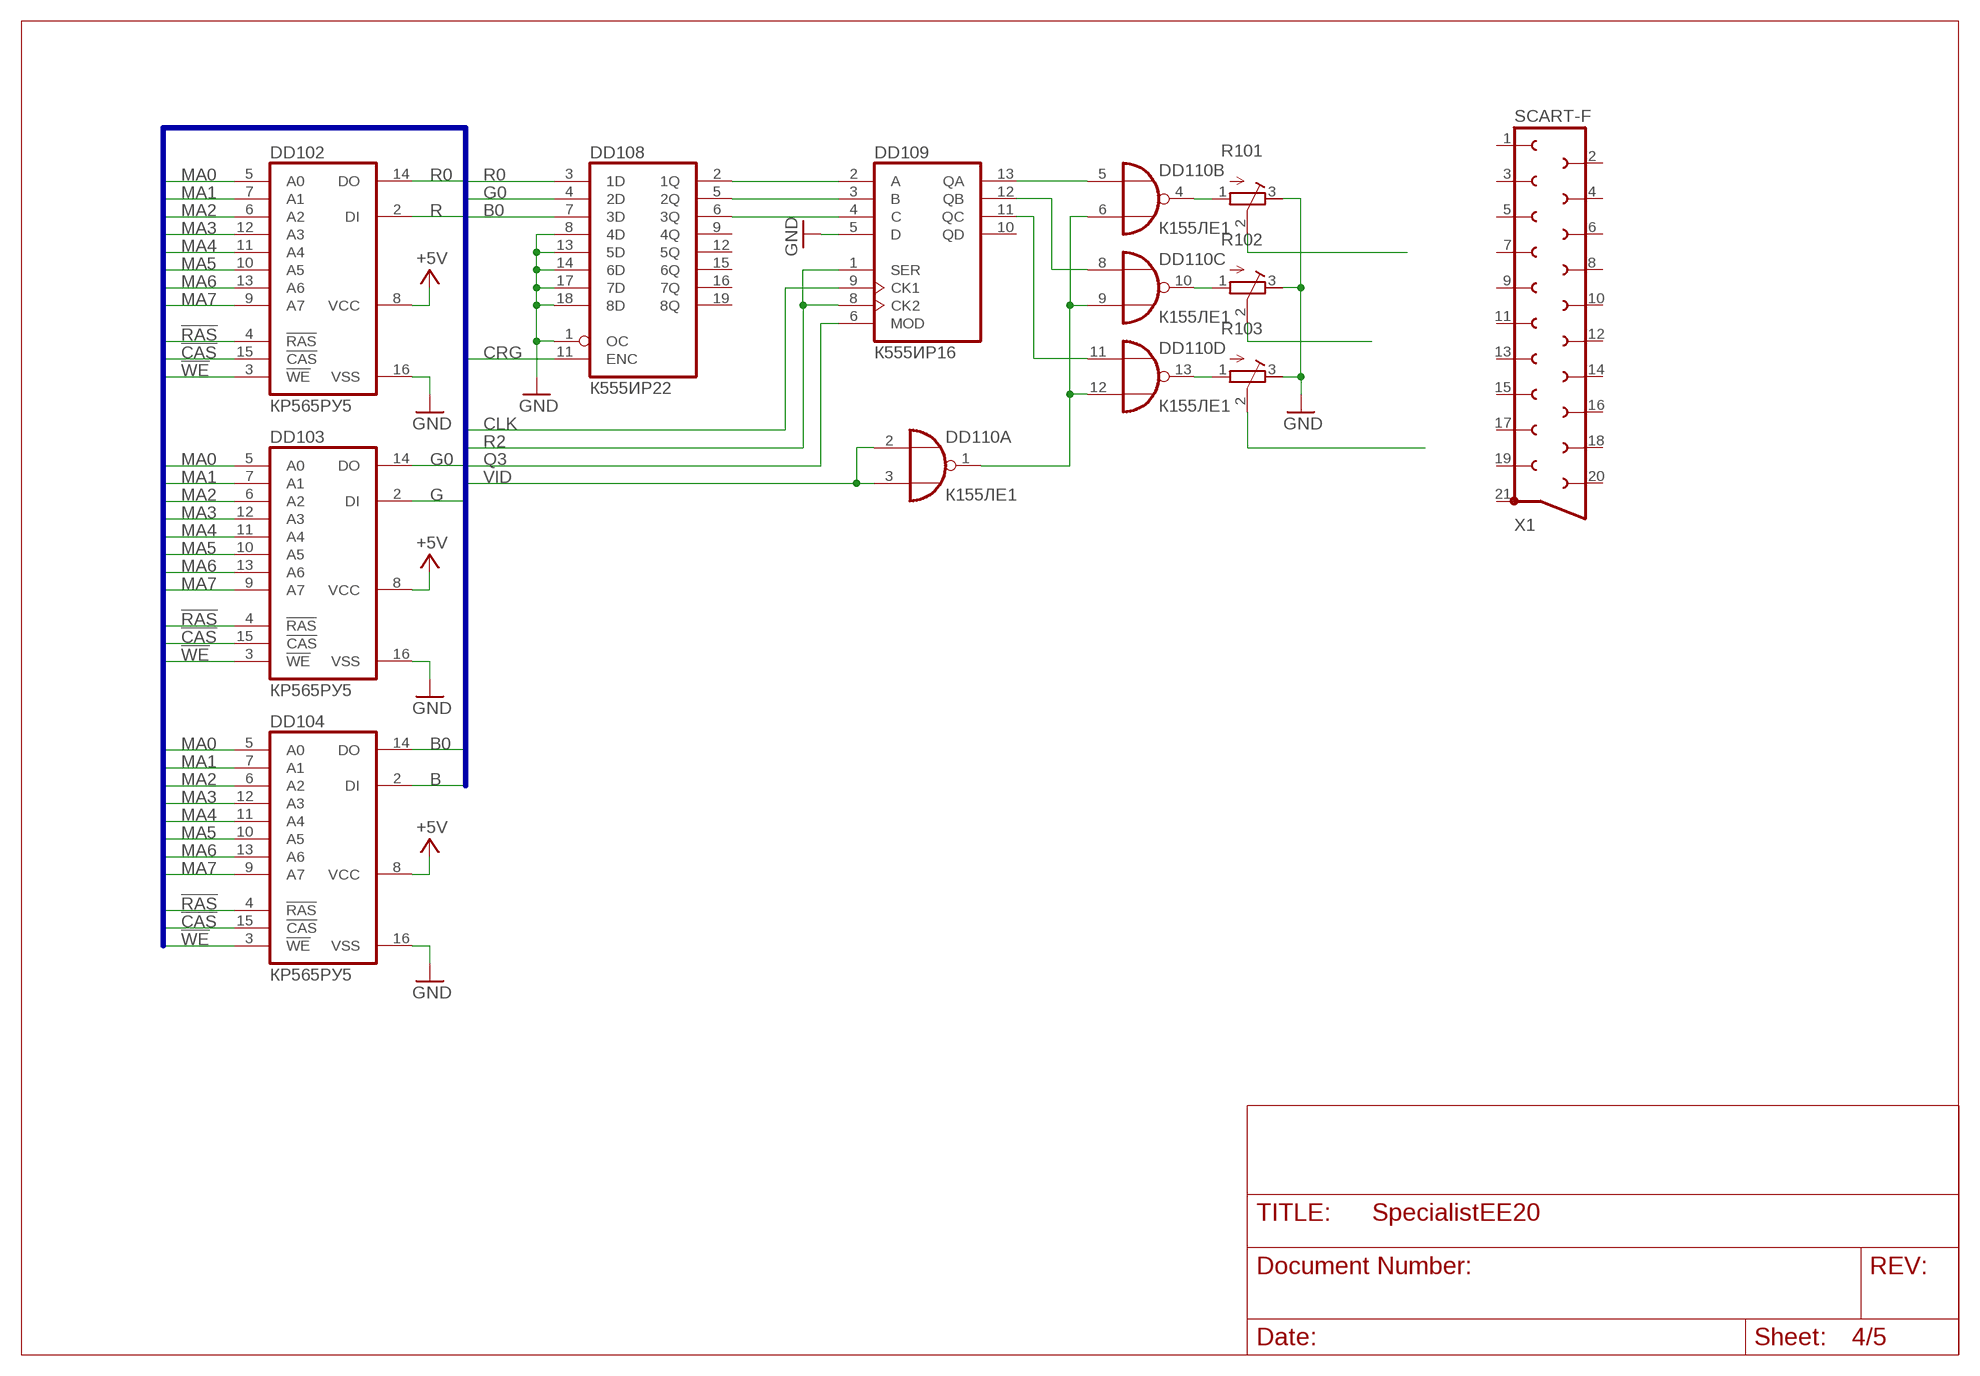
[diagram p3: schematic, sheet 4]

### Parts
DD102  КР565РУ5  2164  [DIL16]
DD103  КР565РУ5  2164  [DIL16]
DD104  КР565РУ5  2164  [DIL16]
DD108  К555ИР22  74LS373N  [DIL20]
DD109  К555ИР16  7495N  [DIL14]
DD110  К155ЛЕ1  7402N  [DIL14]
R101  R-TRIMM3296W  [RTRIM3296W]
R102  R-TRIMM3296W  [RTRIM3296W]
R103  R-TRIMM3296W  [RTRIM3296W]
X1  SCART-F  [SCART-F]

### Nets
!CAS: DD102.15(!CAS) DD103.15(!CAS) DD104.15(!CAS) ; also sheet 2,3
!RAS: DD102.4(!RAS) DD103.4(!RAS) DD104.4(!RAS) ; also sheet 2,3
!WE: DD102.3(!WE) DD103.3(!WE) DD104.3(!WE) ; also sheet 2,3
+5V: DD102.8(VCC) DD103.8(VCC) DD104.8(VCC) ; also sheet 2,3,5
B: DD104.2(DI) ; also sheet 5
B0: DD104.14(DO) DD108.7(3D)
CLK: DD109.9(CK1) ; also sheet 2
CRG: DD108.11(ENC) ; also sheet 2
G: DD103.2(DI) ; also sheet 5
G0: DD103.14(DO) DD108.4(2D)
GND: DD102.16(VSS) DD103.16(VSS) DD104.16(VSS) DD108.1(OC) DD108.8(4D) DD108.13(5D) DD108.14(6D) DD108.17(7D) DD108.18(8D) DD109.5(D) R101.3(E) R102.3(E) R103.3(E) ; also sheet 2,3,5
MA0: DD102.5(A0) DD103.5(A0) DD104.5(A0) ; also sheet 2,3
MA1: DD102.7(A1) DD103.7(A1) DD104.7(A1) ; also sheet 2,3
MA2: DD102.6(A2) DD103.6(A2) DD104.6(A2) ; also sheet 2,3
MA3: DD102.12(A3) DD103.12(A3) DD104.12(A3) ; also sheet 2,3
MA4: DD102.11(A4) DD103.11(A4) DD104.11(A4) ; also sheet 2,3
MA5: DD102.10(A5) DD103.10(A5) DD104.10(A5) ; also sheet 2,3
MA6: DD102.13(A6) DD103.13(A6) DD104.13(A6) ; also sheet 2,3
MA7: DD102.9(A7) DD103.9(A7) DD104.9(A7) ; also sheet 2,3
N$42: DD110.1(A:O) DD110.6(B:I1) DD110.9(C:I1) DD110.12(D:I1)
N$43: DD108.2(1Q) DD109.2(A)
N$45: DD108.5(2Q) DD109.3(B)
N$46: DD108.6(3Q) DD109.4(C)
N$50: DD109.13(QA) DD110.5(B:I0)
N$51: DD109.12(QB) DD110.8(C:I0)
N$52: DD109.11(QC) DD110.11(D:I0)
N$54: DD110.4(B:O) R101.1(A)
N$55: DD110.10(C:O) R102.1(A)
N$56: DD110.13(D:O) R103.1(A)
N$58: R101.2(S)
N$59: R102.2(S)
N$60: R103.2(S)
Q3: DD109.6(MOD) ; also sheet 2
R: DD102.2(DI) ; also sheet 5
R0: DD102.14(DO) DD108.3(1D)
R2: DD109.1(SER) DD109.8(CK2)
VID: DD110.2(A:I0) DD110.3(A:I1) ; also sheet 2
Unconnected: DD108.9(4Q) DD108.12(5Q) DD108.15(6Q) DD108.16(7Q) DD108.19(8Q) DD109.10(QD) X1.1 X1.2 X1.3 X1.4 X1.5 X1.6 X1.7 X1.8 X1.9 X1.10 X1.11 X1.12 X1.13 X1.14 X1.15 X1.16 X1.17 X1.18 X1.19 X1.20 X1.21

### Buses
A[0..15],A'[11..15],D[0..7],F[1..2],G[1..19],!G19A,MA[0..7],MD[0..7],VD[0..11],K[1..27],!RAS,!CAS,CLK,!WE,!WR,X-----X,U7,!U[6..7],!RESIN,RES,RES80,RD,!RD,SNY,STRT,B,G,R,B0,G0,R0,SND,VID,LED,P[1..24],R[1..2],CRG,CS,!R,SH,TON,Q3,MOSI,MISO,SCK

## Sheet 5 of 5
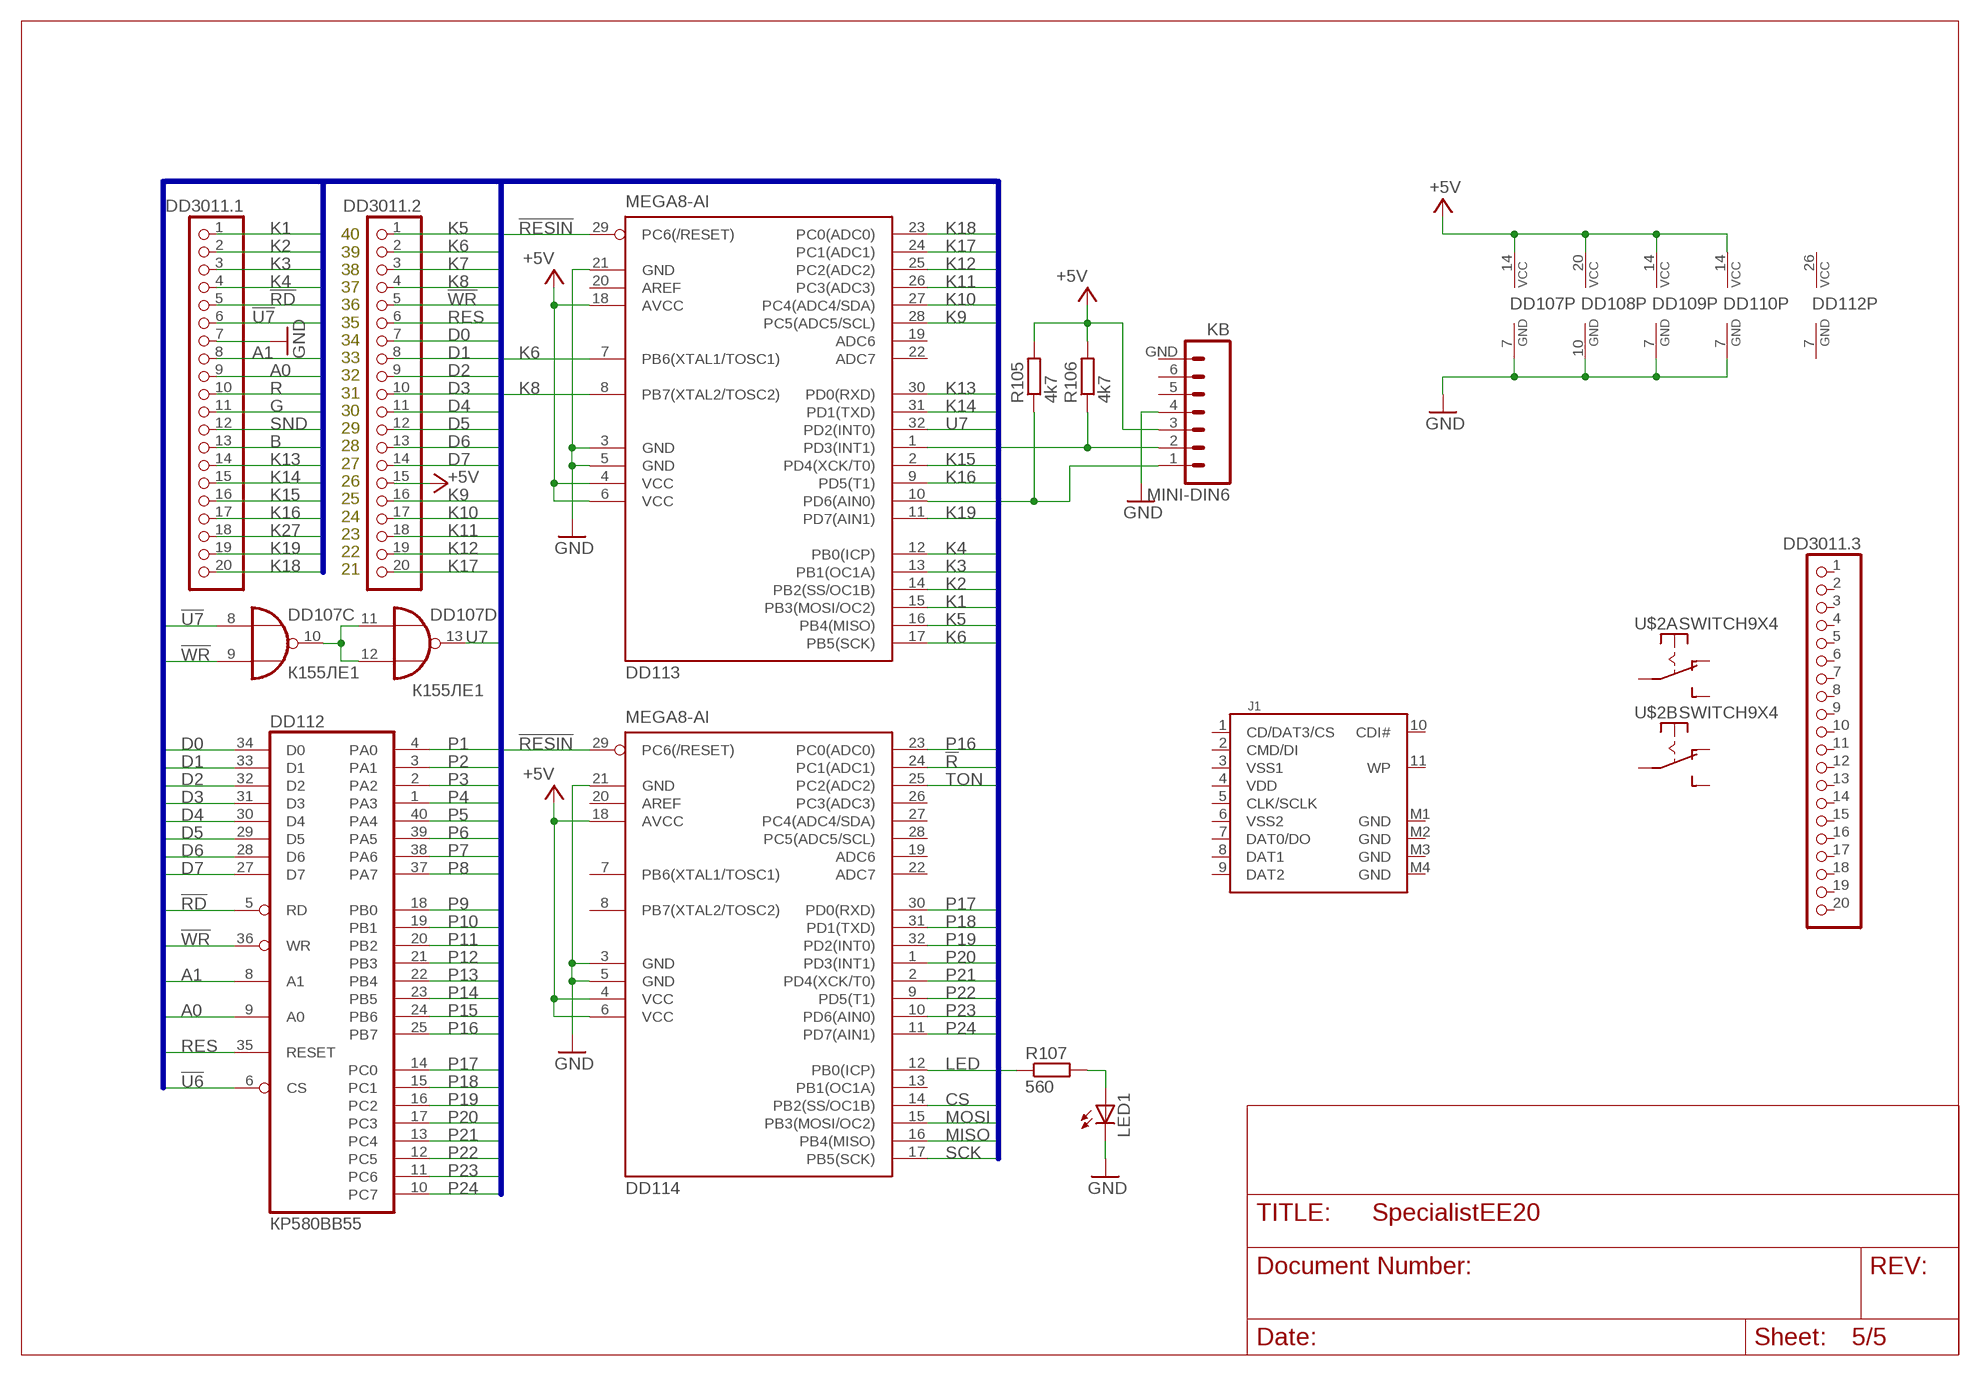
[diagram p4: schematic, sheet 5]

### Parts
DD112  КР580ВВ55  8255A  [DIL40]
DD113  MEGA8-AI  [TQFP32-08]
DD114  MEGA8-AI  [TQFP32-08]
DD3011.1  PINHD-1X20  [1X20]
DD3011.2  PINHD-1X20  [1X20]
DD3011.3  PINHD-1X20  [1X20]
J1  SDCARD  [SDCMF-10915W010]
KB  MINI-DIN6  MINI-DIN6PTH  [MINI-DIN6]
LED1  LED5MM  [LED5MM]
R105  4k7  R-EU_M0805  [M0805]
R106  4k7  R-EU_M0805  [M0805]
R107  560  R-EU_M0805  [M0805]
U$2  SWITCH9X4  [SWITCH9X4]

### Nets
!R: DD114.24(PC1(ADC1))
!RD: DD112.5(RD) DD3011.1.5 ; also sheet 2
!RESIN: DD113.29(PC6(/RESET)) DD114.29(PC6(/RESET))
!U6: DD112.6(CS)
!U7: DD107.8(C:I0) DD3011.1.6 ; also sheet 2
!WR: DD107.9(C:I1) DD112.36(WR) DD3011.2.5 ; also sheet 2
+5V: DD107.14(P:VCC) DD108.20(VCC) DD109.14(VCC) DD110.14(P:VCC) DD113.4(VCC) DD113.6(VCC) DD113.18(AVCC) DD114.4(VCC) DD114.6(VCC) DD114.18(AVCC) DD3011.2.15 KB.3 R105.2 R106.2 ; also sheet 2,3,4
A0: DD112.9(A0) DD3011.1.9 ; also sheet 2
A1: DD112.8(A1) DD3011.1.8 ; also sheet 2
B: DD3011.1.13 ; also sheet 4
CS: DD114.14(PB2(SS/OC1B))
D0: DD112.34(D0) DD3011.2.7 ; also sheet 2
D1: DD112.33(D1) DD3011.2.8 ; also sheet 2
D2: DD112.32(D2) DD3011.2.9 ; also sheet 2
D3: DD112.31(D3) DD3011.2.10 ; also sheet 2
D4: DD112.30(D4) DD3011.2.11 ; also sheet 2
D5: DD112.29(D5) DD3011.2.12 ; also sheet 2
D6: DD112.28(D6) DD3011.2.13 ; also sheet 2
D7: DD112.27(D7) DD3011.2.14 ; also sheet 2
G: DD3011.1.11 ; also sheet 4
GND: DD107.7(P:GND) DD108.10(GND) DD109.7(GND) DD110.7(P:GND) DD113.3(GND) DD113.5(GND) DD113.21(GND) DD114.3(GND) DD114.5(GND) DD114.21(GND) DD3011.1.7 KB.4 LED1.K(C) ; also sheet 2,3,4
K1: DD113.15(PB3(MOSI/OC2)) DD3011.1.1 ; also sheet 2
K2: DD113.14(PB2(SS/OC1B)) DD3011.1.2 ; also sheet 2
K3: DD113.13(PB1(OC1A)) DD3011.1.3 ; also sheet 2
K4: DD113.12(PB0(ICP)) DD3011.1.4 ; also sheet 2
K5: DD113.16(PB4(MISO)) DD3011.2.1 ; also sheet 2
K6: DD113.7(PB6(XTAL1/TOSC1)) DD113.17(PB5(SCK)) DD3011.2.2 ; also sheet 2
K7: DD3011.2.3 ; also sheet 2
K8: DD113.8(PB7(XTAL2/TOSC2)) DD3011.2.4 ; also sheet 2
K9: DD113.28(PC5(ADC5/SCL)) DD3011.2.16 ; also sheet 2
K10: DD113.27(PC4(ADC4/SDA)) DD3011.2.17 ; also sheet 2
K11: DD113.26(PC3(ADC3)) DD3011.2.18 ; also sheet 2
K12: DD113.25(PC2(ADC2)) DD3011.2.19 ; also sheet 2
K13: DD113.30(PD0(RXD)) DD3011.1.14 ; also sheet 2
K14: DD113.31(PD1(TXD)) DD3011.1.15 ; also sheet 2
K15: DD113.2(PD4(XCK/T0)) DD3011.1.16 ; also sheet 2
K16: DD113.9(PD5(T1)) DD3011.1.17 ; also sheet 2
K17: DD113.24(PC1(ADC1)) DD3011.2.20 ; also sheet 2
K18: DD113.23(PC0(ADC0)) DD3011.1.20 ; also sheet 2
K19: DD113.11(PD7(AIN1)) DD3011.1.19 ; also sheet 2
K27: DD3011.1.18 ; also sheet 2
LED: DD114.12(PB0(ICP)) R107.1
MISO: DD114.16(PB4(MISO))
MOSI: DD114.15(PB3(MOSI/OC2))
N$35: DD113.1(PD3(INT1)) KB.2 R106.1
N$39: DD113.10(PD6(AIN0)) KB.1 R105.1
N$40: DD107.10(C:O) DD107.11(D:I0) DD107.12(D:I1)
N$48: LED1.A R107.2
P1: DD112.4(PA0)
P2: DD112.3(PA1)
P3: DD112.2(PA2)
P4: DD112.1(PA3)
P5: DD112.40(PA4)
P6: DD112.39(PA5)
P7: DD112.38(PA6)
P8: DD112.37(PA7)
P9: DD112.18(PB0)
P10: DD112.19(PB1)
P11: DD112.20(PB2)
P12: DD112.21(PB3)
P13: DD112.22(PB4)
P14: DD112.23(PB5)
P15: DD112.24(PB6)
P16: DD112.25(PB7) DD114.23(PC0(ADC0))
P17: DD112.14(PC0) DD114.30(PD0(RXD))
P18: DD112.15(PC1) DD114.31(PD1(TXD))
P19: DD112.16(PC2) DD114.32(PD2(INT0))
P20: DD112.17(PC3) DD114.1(PD3(INT1))
P21: DD112.13(PC4) DD114.2(PD4(XCK/T0))
P22: DD112.12(PC5) DD114.9(PD5(T1))
P23: DD112.11(PC6) DD114.10(PD6(AIN0))
P24: DD112.10(PC7) DD114.11(PD7(AIN1))
R: DD3011.1.10 ; also sheet 4
RES: DD112.35(RESET) DD3011.2.6 ; also sheet 2
SCK: DD114.17(PB5(SCK))
SND: DD3011.1.12
TON: DD114.25(PC2(ADC2))
U7: DD107.13(D:O) DD113.32(PD2(INT0))
Unconnected: DD113.19(ADC6) DD113.20(AREF) DD113.22(ADC7) DD114.7(PB6(XTAL1/TOSC1)) DD114.8(PB7(XTAL2/TOSC2)) DD114.13(PB1(OC1A)) DD114.19(ADC6) DD114.20(AREF) DD114.22(ADC7) DD114.26(PC3(ADC3)) DD114.27(PC4(ADC4/SDA)) DD114.28(PC5(ADC5/SCL)) DD3011.3.1 DD3011.3.2 DD3011.3.3 DD3011.3.4 DD3011.3.5 DD3011.3.6 DD3011.3.7 DD3011.3.8 DD3011.3.9 DD3011.3.10 DD3011.3.11 DD3011.3.12 DD3011.3.13 DD3011.3.14 DD3011.3.15 DD3011.3.16 DD3011.3.17 DD3011.3.18 DD3011.3.19 DD3011.3.20 J1.1(CD/DAT3/CS) J1.2(CMD/DI) J1.5(CLK/SCLK) J1.7(DAT0/DO) J1.8(DAT1) J1.9(DAT2) J1.10(CDI#) J1.11(WP) KB.5 KB.6 KB.GND U$2.10(A:P) U$2.11(A:O) U$2.12(A:S) U$2.20(B:P) U$2.21(B:O) U$2.22(B:S)

### Buses
A[0..15],A'[11..15],D[0..7],F[1..2],G[1..19],!G19A,MA[0..7],MD[0..7],VD[0..11],K[1..27],!RAS,!CAS,CLK,!WE,!WR,X-----X,U7,!U[6..7],!RESIN,RES,RES80,RD,!RD,SNY,STRT,B,G,R,B0,G0,R0,SND,VID,LED,P[1..24],R[1..2],CRG,CS,!R,SH,TON,Q3,MOSI,MISO,SCK

### Notes on the sheet
- 40
  39
  38
  37
  36
  35
  34
  33
  32
  31
  30
  29
  28
  27
  26
  25
  24
  23
  22
  21

## Power pins joined to a net without a drawn wire
GND: 27512.14(GND) DD30.7(GND) DD37.12(GND) DD38.12(GND) DD39.14(GND) DD45.7(P:GND) DD112.7(GND) J1.M1(GND) J1.M2(GND) J1.M3(GND) J1.M4(GND)
VCC: 27512.28(VCC) DD30.26(VCC) DD37.24(VCC) DD38.24(VCC) DD39.28(VCC) DD45.14(P:VCC) DD112.26(VCC)
VDD: J1.4(VDD)
VSS1: J1.3(VSS1)
VSS2: J1.6(VSS2)

## Library data of the parts
27512 = memory:27512: MEMORY
C1 C4 C4' C5 C6 C11 = rcl:C-EU: CAPACITOR, European symbol
C3 C7 C10 = rcl:CPOL-EU: POLARIZED CAPACITOR, European symbol
DD1 DD9 = 74xx-eu:74*04: Hex INVERTER
DD2 DD8 = 74xx-eu:74*192: Synchronous 4-bit UP/DOWN COUNTER
DD3-DD5 = 74xx-eu:74*93: Decade, divide by twelve and binary COUNTER
DD6 DD107 DD110 = 74xx-eu:74*02: Quad 2-input NOR gate
DD7 = 74xx-eu:74*10: Triple 3-input NAND gate
DD10 = 74xx-eu:74*30: 8-input NAND gate
DD11 DD14 = 74xx-eu:74*00: Quad 2-input NAND gate
DD12 = 74xx-eu:74*74: Dual D type positive edge triggered FLIP FLOP, preset and clear
DD15-DD18 = 74xx-eu:74*153: Dual 4-line to 1-line data SELECTOR/MULTIPLEXER
DD19 = 74xx-eu:74*365: Hex BUS DRIVER, 3-state
DD20 = 74xx-eu:74*01: Quad 2-input NAND gate, open collector
DD21-DD28 DD102-DD104 = memory:2164: MEMORY
DD29 = micro-intel:8080: MICROCOMPUTER/PERIPHERAL DEVICE; OC_FARNELL: unknown; OC_NEWARK: unknown
DD30 DD112 = micro-intel:8255A: MICROCOMPUTER/PERIPHERAL DEVICE; OC_FARNELL: unknown; OC_NEWARK: unknown
DD31 DD108 = 74xx-eu:74*373: Octal D type transparent LATCH, edge triggered
DD32 DD33 DD109 = 74xx-eu:74*95: 4-bit parallel access SHIFT REGISTER
DD34 = 74xx-eu:74*245: Octal BUS TRANSCEIVER, 3-state
DD36 DD40 = 74xx-eu:74*155: Dual 2-line to 4-line data DECODER/DEMULTIPLEXER
DD37 DD38 = memory:2716: MEMORY
DD39 = memory:2764: MEMORY
DD45 = 74xx-eu:74*393: Dual 4-bit decade and binary COUNTER
DD113 DD114 = atmel:MEGA8: MICROCONTROLLER 8 Kbytes FLASH, 1 kbytes SRAM, 512 bytes EEPROM, USART, 6-channel 10 bit ADC, 2-channel 8 bit ADC Pin compatible with Atmega48, ATMega88, ATMega168 Source: avr.lbr; MPN: ATMEGA8-16AU; OC_FARNELL: 9171371; OC_NEWARK: 73M8863
DD3011.1-DD3011.3 = Разъёмы штырьковые 2.54мм:PINHD-1X20: PIN HEADER
J1 = Speccy:SDCARD: SD card connector KINGFONT SDCMF-10915W010
JP1 = Разъёмы штырьковые 2.54мм:PINHD-1X1: PIN HEADER
JP2 JP3 = Разъёмы штырьковые 2.54мм:PINHD-1X40: PIN HEADER
KB = Speccy:MINI-DIN6: mini DIN 6 Connector Commonly found on the back of a computer for PS2 keyboard and mice. Schematic and footprint are proven. Spark Fun Electronics SKU : PRT-08509
LED1 = led:LED: LED OSRAM: - CHIPLED LG R971, LG N971, LY N971, LG Q971, LY Q971, LO R971, LY R971 LH N974, LH R974 LS Q976, LO Q976, LY Q976 LO Q996 - Hyper CHIPLED LW Q18S LB Q993, LB Q99A, LB R99A - SideLED LS A670, LO A670, LY A670, LG A670, LP A670 LB A673, LV A673, LT A673, LW A673 LH A674 LY A675 LS A676, LA A676, LO A676, LY A676, LW A676 LS A679, LY A679, LG A679 - Hyper Micro SIDELED® LS Y876, LA Y876, LO Y876, LY Y876 LT Y87S - SmartLED LW L88C, LW L88S LB L89C, LB L89S, LG L890 LS L89K, LO L89K, LY L89K LS L896, LA L896, LO L896, LY L896 - TOPLED LS T670, LO T670, LY T670, LG T670, LP T670 LSG T670, LSP T670, LSY T670, LOP T670, LYG T670 LG T671, LOG T671, LSG T671 LB T673, LV T673, LT T673, LW T673 LH T674 LS T676, LA T676, LO T676, LY T676, LB T676, LH T676, LSB T676, LW T676 LB T67C, LV T67C, LT T67C, LS T67K, LO T67K, LY T67K, LW E67C LS E67B, LA E67B, LO E67B, LY E67B, LB E67C, LV E67C, LT E67C LW T67C LS T679, LY T679, LG T679 LS T770, LO T770, LY T770, LG T770, LP T770 LB T773, LV T773, LT T773, LW T773 LH T774 LS E675, LA E675, LY E675, LS T675 LS T776, LA T776, LO T776, LY T776, LB T776 LHGB T686 LT T68C, LB T68C - Hyper Mini TOPLED® LB M676 - Mini TOPLED Santana® LG M470 LS M47K, LO M47K, LY M47K Source: http://www.osram.convergy.de LUXEON: - LUMILED® LXK2-PW12-R00, LXK2-PW12-S00, LXK2-PW14-U00, LXK2-PW14-V00 LXK2-PM12-R00, LXK2-PM12-S00, LXK2-PM14-U00 LXK2-PE12-Q00, LXK2-PE12-R00, LXK2-PE12-S00, LXK2-PE14-T00, LXK2-PE14-U00 LXK2-PB12-K00, LXK2-PB12-L00, LXK2-PB12-M00, LXK2-PB14-N00, LXK2-PB14-P00, LXK2-PB14-Q00 LXK2-PR12-L00, LXK2-PR12-M00, LXK2-PR14-Q00, LXK2-PR14-R00 LXK2-PD12-Q00, LXK2-PD12-R00, LXK2-PD12-S00 LXK2-PH12-R00, LXK2-PH12-S00 LXK2-PL12-P00, LXK2-PL12-Q00, LXK2-PL12-R00 Source: www.luxeon.com KINGBRIGHT: KA-3528ASYC Source: www.kingbright.com
R1-R6 R9-R11 R13 R14 R23 R47 R48 R105-R107 RD1 RD2 = rcl:R-EU_: RESISTOR, European symbol
R101-R103 = rcl:R-TRIMM: Trimm resistor
U$2 = ESR_NM8032:SWITCH9X4
VD1 VD2 VD4-VD7 VD9 VD10 = diode:DIODE-: DIODE
VD3 VD3* = diode:ZENER-DIODE: Z-Diode
VD8 = diode:1N4004: DIODE general purpose rectifier, 1 A
X1 = con-hirschmann:SCART-F: TV SCART CONNECTOR; OC_FARNELL: unknown; OC_NEWARK: unknown
Z1 = crystal:CRYSTAL: CRYSTAL; OC_FARNELL: 1667008; OC_NEWARK: unknown

## Board
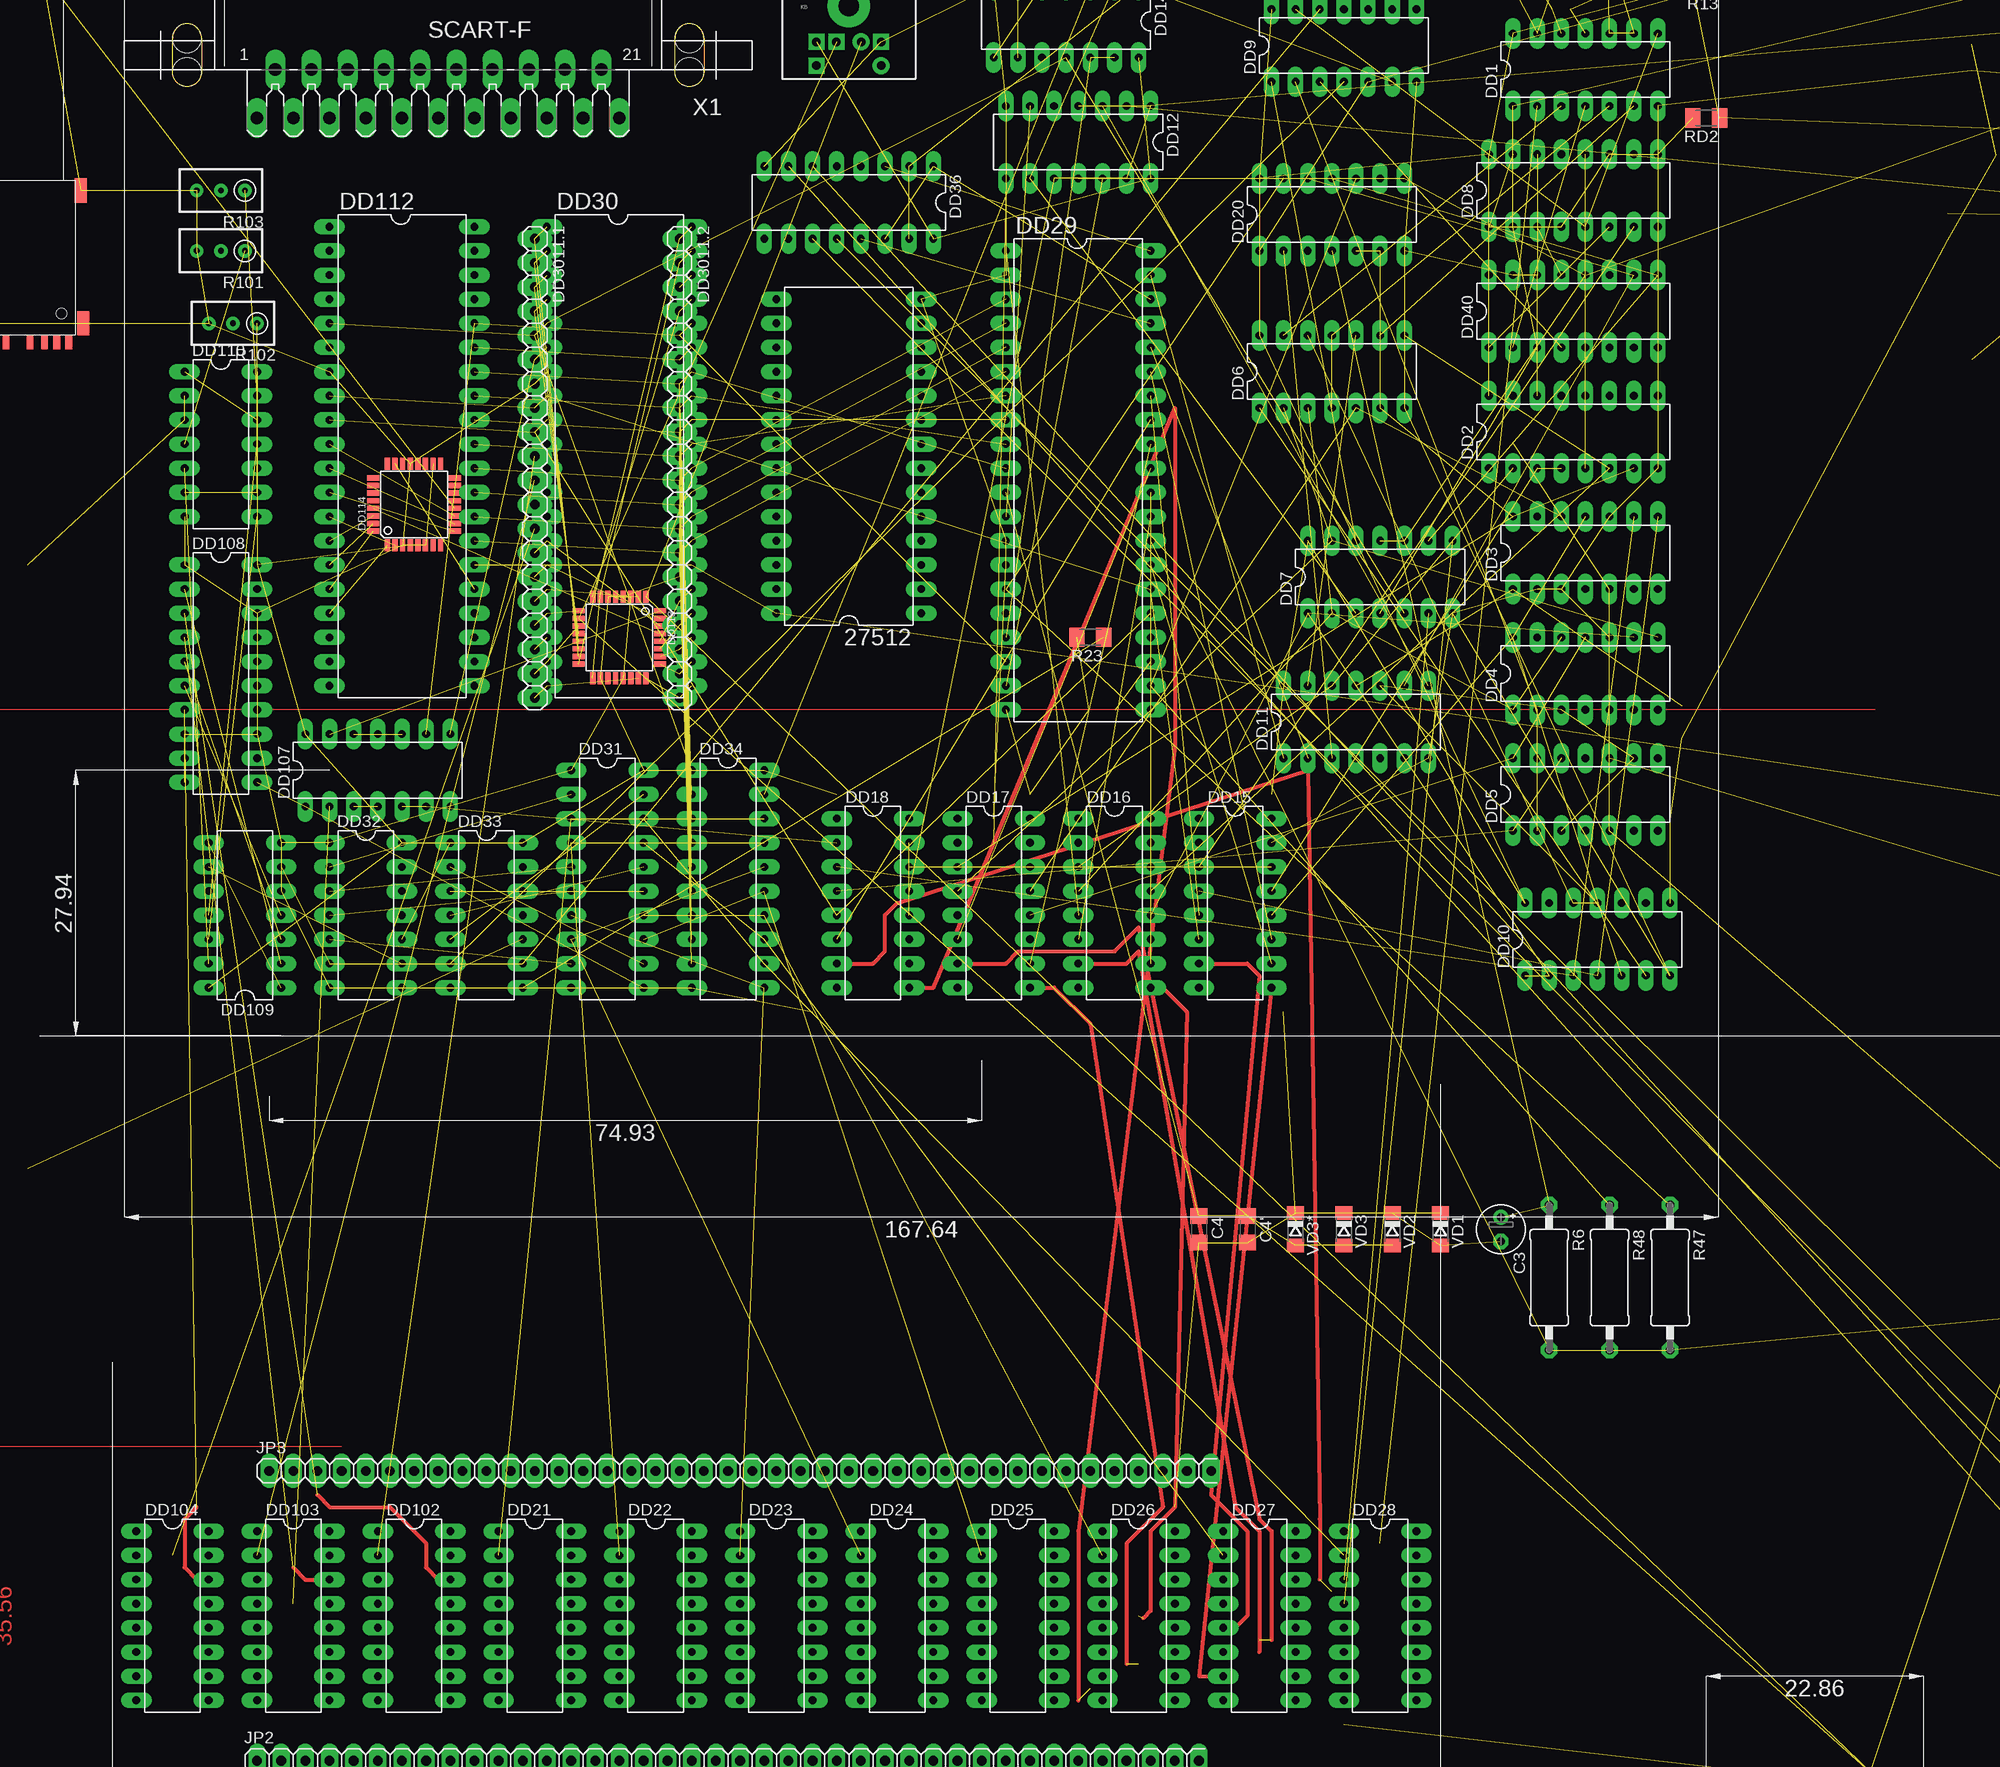
[diagram p5: board, top side]
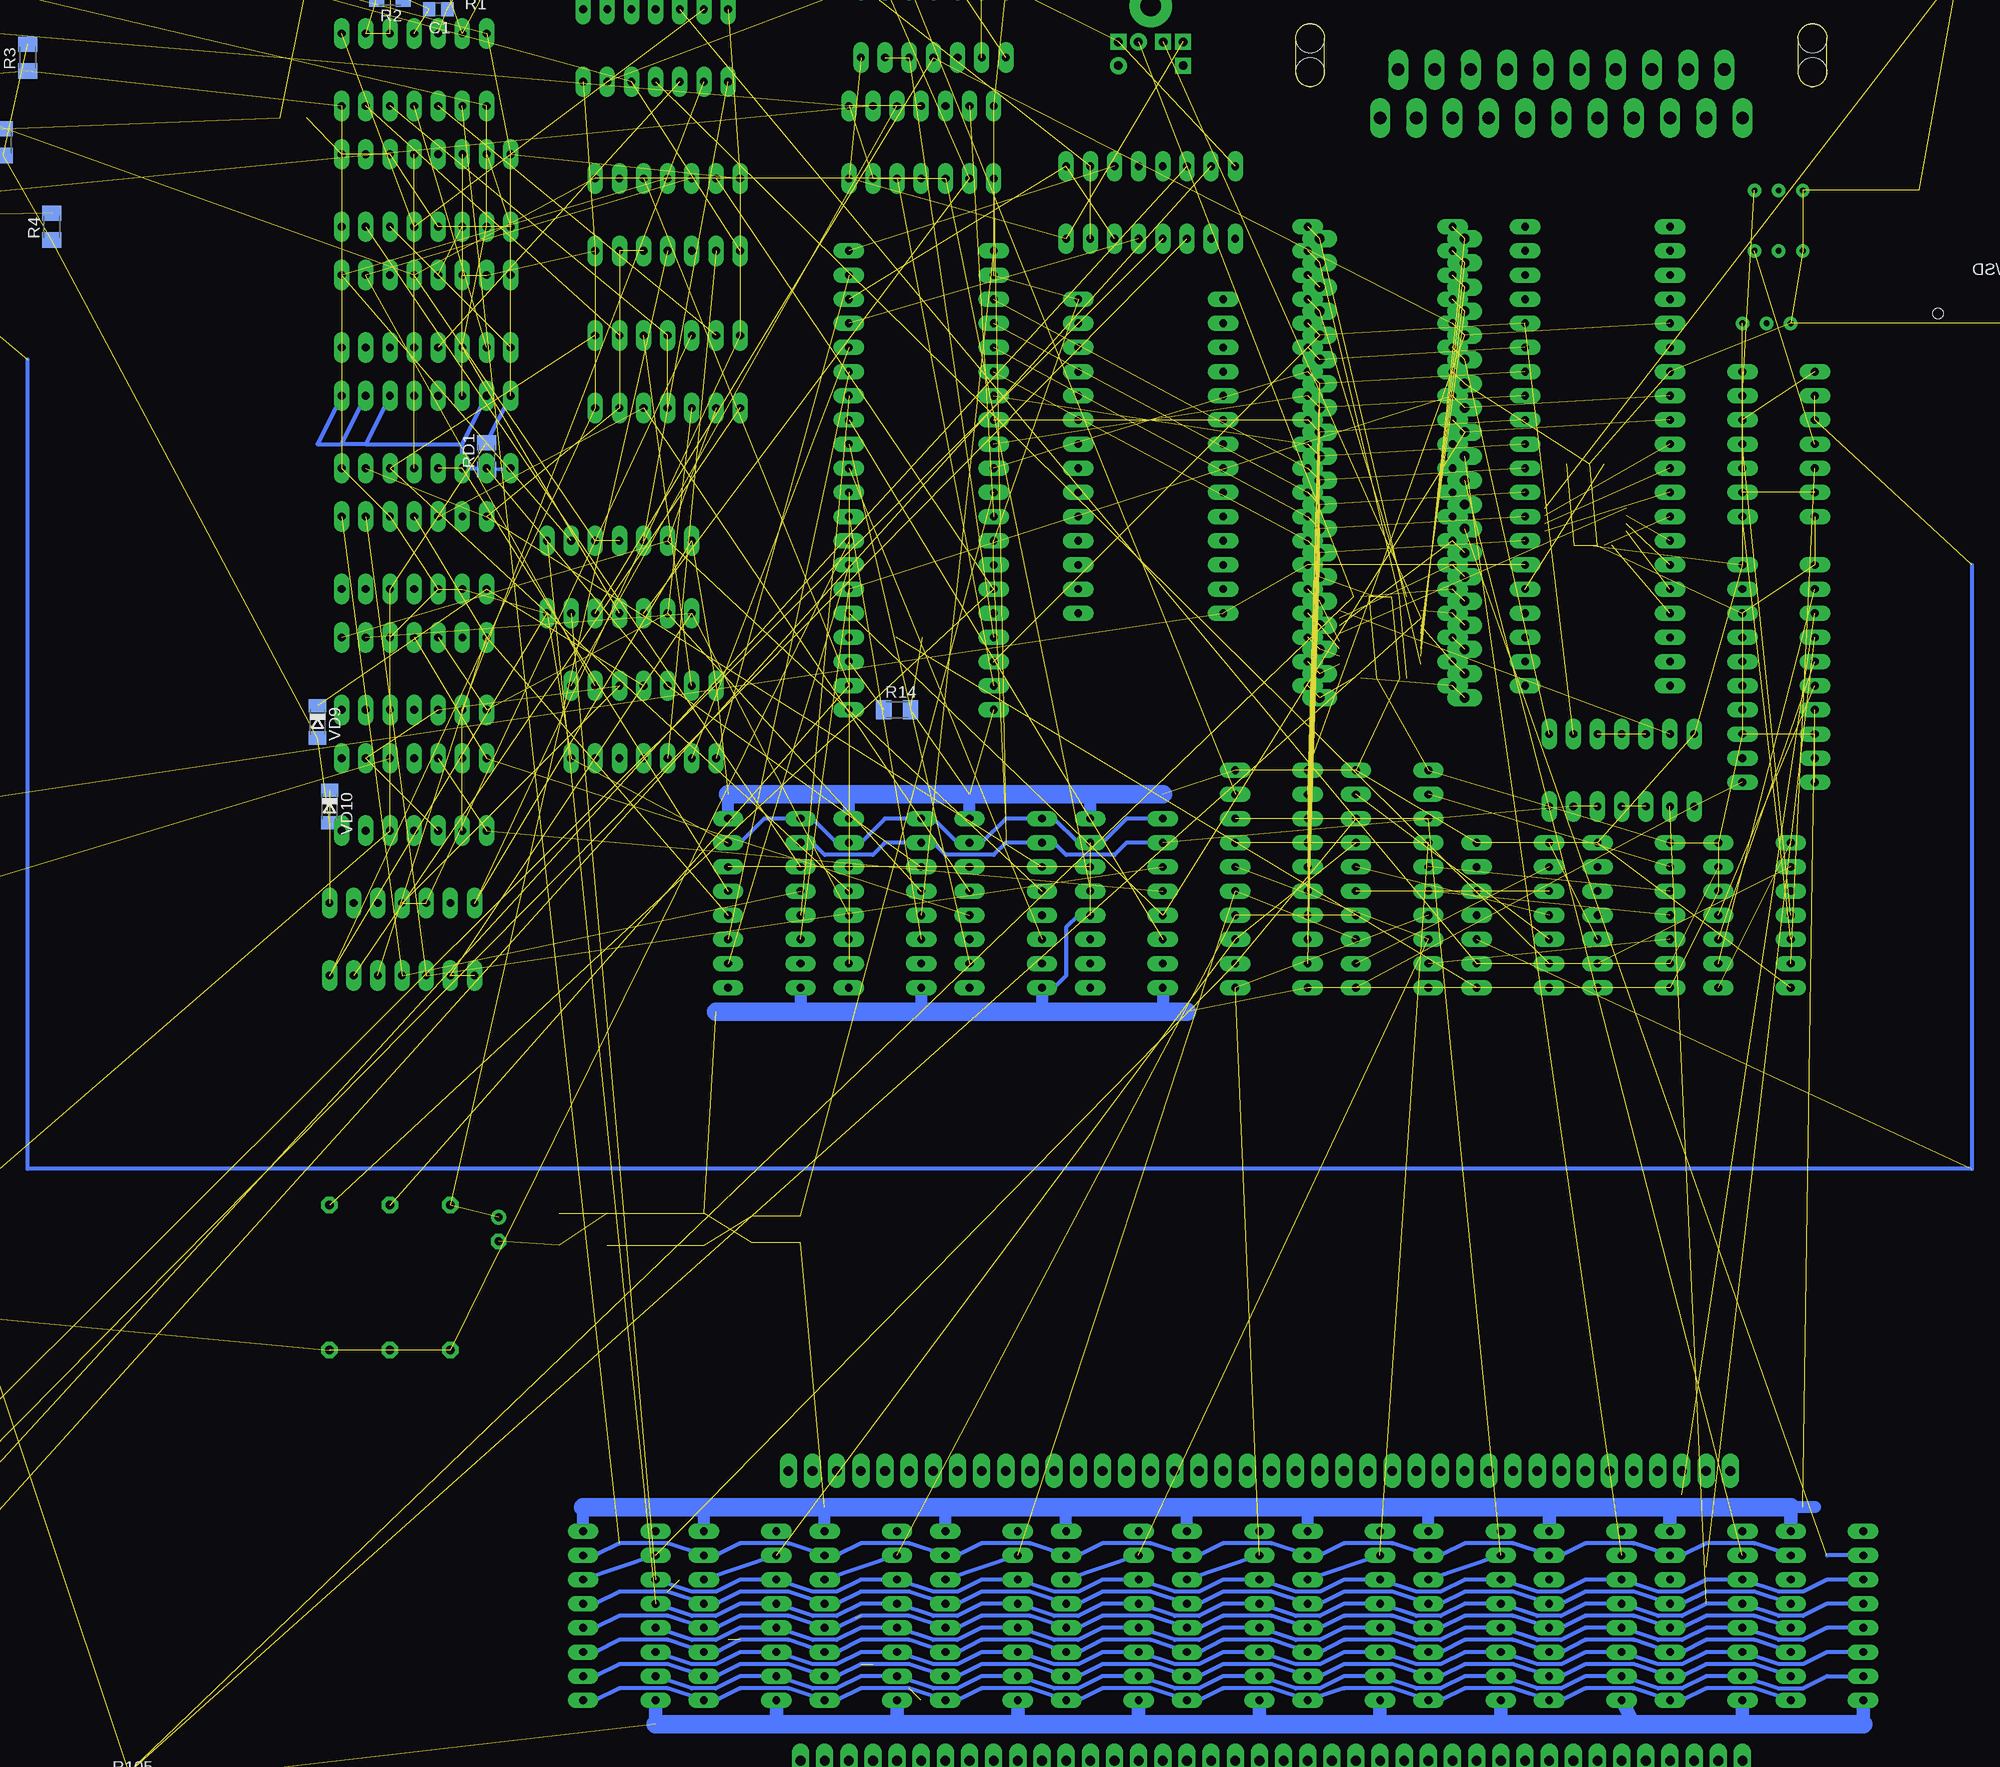
[diagram p6: board, bottom side, seen from below]

Size 55.88 x 6.6 mm. Coordinates in mm from the lower left corner, seen from the top.
Copper layers (1*16): Top 0.035mm / dielectric 1.5mm / Bottom 0.035mm
Design rules "speccy2007": minimum track width 10mil, minimum drill 24mil, track to track 8mil, track to pad 8mil, pad to pad 8mil, via to via 8mil, smd to smd 8mil, copper to edge 40mil, drill to drill 7mil, minimum pad ring 0.4mm, minimum via ring 8mil, stop-mask expansion 4mil, vias tented up to drill 0mil, thermal gap 10mil

### Footprints (pad centres in the part's own frame; a part is rotated, then mirrored left to right if it is on the bottom)
DIL28 = drill 0.813 long: 1 -16.51,-7.62; 2 -13.97,-7.62; 3 -11.43,-7.62; 4 -8.89,-7.62; 5 -6.35,-7.62; 6 -3.81,-7.62; 7 -1.27,-7.62; 8 1.27,-7.62; 9 3.81,-7.62; 10 6.35,-7.62; 11 8.89,-7.62; 12 11.43,-7.62; 13 13.97,-7.62; 14 16.51,-7.62; 15 16.51,7.62; 16 13.97,7.62; 17 11.43,7.62; 18 8.89,7.62; 19 6.35,7.62; 20 3.81,7.62; 21 1.27,7.62; 22 -1.27,7.62; 23 -3.81,7.62; 24 -6.35,7.62; 25 -8.89,7.62; 26 -11.43,7.62; 27 -13.97,7.62; 28 -16.51,7.62
C0805 = smd 1.3 x 1.5: 1 -0.95,0; 2 0.95,0
E2,5-5 = drill 0.813 pad 1.6: + -1.27,0 | drill 0.813 pad 1.6 octagon: - 1.27,0
C1206 = smd 1.6 x 1.8: 1 -1.4,0; 2 1.4,0
DIL14 = drill 0.813 long: 1 -7.62,-3.81; 2 -5.08,-3.81; 3 -2.54,-3.81; 4 0,-3.81; 5 2.54,-3.81; 6 5.08,-3.81; 7 7.62,-3.81; 8 7.62,3.81; 9 5.08,3.81; 10 2.54,3.81; 11 0,3.81; 12 -2.54,3.81; 13 -5.08,3.81; 14 -7.62,3.81
DIL16 = drill 0.813 long: 1 -8.89,-3.81; 2 -6.35,-3.81; 3 -3.81,-3.81; 4 -1.27,-3.81; 5 1.27,-3.81; 6 3.81,-3.81; 7 6.35,-3.81; 8 8.89,-3.81; 9 8.89,3.81; 10 6.35,3.81; 11 3.81,3.81; 12 1.27,3.81; 13 -1.27,3.81; 14 -3.81,3.81; 15 -6.35,3.81; 16 -8.89,3.81
DIL40 = drill 0.813 long: 1 -24.13,-7.62; 2 -21.59,-7.62; 3 -19.05,-7.62; 4 -16.51,-7.62; 5 -13.97,-7.62; 6 -11.43,-7.62; 7 -8.89,-7.62; 8 -6.35,-7.62; 9 -3.81,-7.62; 10 -1.27,-7.62; 11 1.27,-7.62; 12 3.81,-7.62; 13 6.35,-7.62; 14 8.89,-7.62; 15 11.43,-7.62; 16 13.97,-7.62; 17 16.51,-7.62; 18 19.05,-7.62; 19 21.59,-7.62; 20 24.13,-7.62; 21 24.13,7.62; 22 21.59,7.62; 23 19.05,7.62; 24 16.51,7.62; 25 13.97,7.62; 26 11.43,7.62; 27 8.89,7.62; 28 6.35,7.62; 29 3.81,7.62; 30 1.27,7.62; 31 -1.27,7.62; 32 -3.81,7.62; 33 -6.35,7.62; 34 -8.89,7.62; 35 -11.43,7.62; 36 -13.97,7.62; 37 -16.51,7.62; 38 -19.05,7.62; 39 -21.59,7.62; 40 -24.13,7.62
DIL20 = drill 0.813 long: 1 -11.43,-3.81; 2 -8.89,-3.81; 3 -6.35,-3.81; 4 -3.81,-3.81; 5 -1.27,-3.81; 6 1.27,-3.81; 7 3.81,-3.81; 8 6.35,-3.81; 9 8.89,-3.81; 10 11.43,-3.81; 11 11.43,3.81; 12 8.89,3.81; 13 6.35,3.81; 14 3.81,3.81; 15 1.27,3.81; 16 -1.27,3.81; 17 -3.81,3.81; 18 -6.35,3.81; 19 -8.89,3.81; 20 -11.43,3.81
DIL24 = drill 0.813 long: 1 -13.97,-7.62; 2 -11.43,-7.62; 3 -8.89,-7.62; 4 -6.35,-7.62; 5 -3.81,-7.62; 6 -1.27,-7.62; 7 1.27,-7.62; 8 3.81,-7.62; 9 6.35,-7.62; 10 8.89,-7.62; 11 11.43,-7.62; 12 13.97,-7.62; 13 13.97,7.62; 14 11.43,7.62; 15 8.89,7.62; 16 6.35,7.62; 17 3.81,7.62; 18 1.27,7.62; 19 -1.27,7.62; 20 -3.81,7.62; 21 -6.35,7.62; 22 -8.89,7.62; 23 -11.43,7.62; 24 -13.97,7.62
TQFP32-08 = smd 1.27 x 0.559: 1 -4.293,2.8; 2 -4.293,2; 3 -4.293,1.2; 4 -4.293,0.4; 5 -4.293,-0.4; 6 -4.293,-1.2; 7 -4.293,-2; 8 -4.293,-2.8; 17 4.293,-2.8; 18 4.293,-2; 19 4.293,-1.2; 20 4.293,-0.4; 21 4.293,0.4; 22 4.293,1.2; 23 4.293,2; 24 4.293,2.8 | smd 0.559 x 1.27: 9 -2.8,-4.293; 10 -2,-4.293; 11 -1.2,-4.293; 12 -0.4,-4.293; 13 0.4,-4.293; 14 1.2,-4.293; 15 2,-4.293; 16 2.8,-4.293; 25 2.8,4.293; 26 2,4.293; 27 1.2,4.293; 28 0.4,4.293; 29 -0.4,4.293; 30 -1.2,4.293; 31 -2,4.293; 32 -2.8,4.293
1X20 = drill 1.016 long: 1 -24.13,0; 2 -21.59,0; 3 -19.05,0; 4 -16.51,0; 5 -13.97,0; 6 -11.43,0; 7 -8.89,0; 8 -6.35,0; 9 -3.81,0; 10 -1.27,0; 11 1.27,0; 12 3.81,0; 13 6.35,0; 14 8.89,0; 15 11.43,0; 16 13.97,0; 17 16.51,0; 18 19.05,0; 19 21.59,0; 20 24.13,0
SDCMF-10915W010 = smd 0.711 x 1.422: 1 7.366,13.462; 2 4.826,13.462; 3 2.286,13.462; 4 -0.254,13.462; 5 -2.794,13.462; 6 -5.334,13.462; 7 -7.874,13.462; 8 -9.398,13.462; 9 9.906,13.462; 10 -11.938,13.462; 11 -10.668,13.462 | smd 1.27 x 2.54: M1 12.43,11.43; M2 13.97,-2.54; M3 -13.208,-2.54; M4 -13.446,11.43 | hole 1.6: 9.906,10.414 | hole 1.1: -11.176,10.414
1X01 = drill 1.016 octagon: 1 0,0
1X40 = drill 1.016 long: 1 -49.53,0; 2 -46.99,0; 3 -44.45,0; 4 -41.91,0; 5 -39.37,0; 6 -36.83,0; 7 -34.29,0; 8 -31.75,0; 9 -29.21,0; 10 -26.67,0; 11 -24.13,0; 12 -21.59,0; 13 -19.05,0; 14 -16.51,0; 15 -13.97,0; 16 -11.43,0; 17 -8.89,0; 18 -6.35,0; 19 -3.81,0; 20 -1.27,0; 21 1.27,0; 22 3.81,0; 23 6.35,0; 24 8.89,0; 25 11.43,0; 26 13.97,0; 27 16.51,0; 28 19.05,0; 29 21.59,0; 30 24.13,0; 31 26.67,0; 32 29.21,0; 33 31.75,0; 34 34.29,0; 35 36.83,0; 36 39.37,0; 37 41.91,0; 38 44.45,0; 39 46.99,0; 40 49.53,0
MINI-DIN6 = drill 0.9 pad 1.676 square: 1 -1.3,-8.5; 3 -3.4,-8.5; 4 3.4,-8.5; 5 -3.4,-11 | drill 0.9 pad 1.778: 2 1.3,-8.5; 6 3.4,-11 | drill 2.2 pad 4.5: GND 0,-4.7
LED5MM = drill 0.813 octagon: A -1.27,0; K 1.27,0
M1206 = smd 1.6 x 2: 1 -1.4,0; 2 1.4,0
0411/15 = drill 0.914 octagon: 1 -7.62,0; 2 7.62,0
RTRIM3296W = drill 0.61: 1 0,-2.54; 2 0,0; 3 0,2.54
M0805 = smd 1.3 x 1.6: 1 -0.95,0; 2 0.95,0
SWITCH9X4 = drill 0.8 pad 2.184: 10 -1.587,0; 11 -1.587,2.54; 12 -1.587,-2.54; 20 1.587,0; 21 1.587,2.54; 22 1.587,-2.54
SOD80C = smd 1.4 x 1.8: A 1.7,0; C -1.7,0
DO41-10 = drill 1.118: A 5.08,0; C -5.08,0
SCART-F = drill 1.321 long: 1 19.05,5.08; 2 17.145,0; 3 15.24,5.08; 4 13.335,0; 5 11.43,5.08; 6 9.525,0; 7 7.62,5.08; 8 5.715,0; 9 3.81,5.08; 10 1.905,0; 11 0,5.08; 12 -1.905,0; 13 -3.81,5.08; 14 -5.715,0; 15 -7.62,5.08; 16 -9.525,0; 17 -11.43,5.08; 18 -13.335,0; 19 -15.24,5.08; 20 -17.145,0; 21 -19.05,5.08 | hole 3.023: 26.416,0.254; 26.416,-3.302; -26.416,0.254; -26.416,-3.302
HC49/S = drill 0.813: 1 -2.413,0; 2 2.413,0

### Placement (x,y rotation side)
27512  71.12,-38.86 90 top  (outside the outline)
C1  146.05,8.13 180 bottom  (outside the outline)
C3  139.7,-120.14 270 top  (outside the outline)
C4  107.95,-120.14 270 top  (outside the outline)
C4'  113.03,-120.14 270 top  (outside the outline)
C5  204.47,0.51 0 bottom  (outside the outline)
C6  204.47,13.21 0 bottom  (outside the outline)
C7  205.74,-12.19 0 top  (outside the outline)
C10  198.12,-22.35 0 top  (outside the outline)
C11  196.85,-13.46 0 top  (outside the outline)
DD1  148.59,1.78 0 top  (outside the outline)
DD2  147.32,-36.32 0 top  (outside the outline)
DD3  148.59,-49.02 0 top  (outside the outline)
DD4  148.59,-61.72 0 top  (outside the outline)
DD5  148.59,-74.42 0 top  (outside the outline)
DD6  121.92,-29.97 0 top  (outside the outline)
DD7  127,-51.56 0 top  (outside the outline)
DD8  147.32,-10.92 0 top  (outside the outline)
DD9  123.19,4.32 0 top  (outside the outline)
DD10  149.86,-89.66 0 top  (outside the outline)
DD11  124.46,-66.8 0 top  (outside the outline)
DD12  95.25,-5.84 180 top  (outside the outline)
DD14  93.98,6.86 180 top  (outside the outline)
DD15  111.76,-85.85 270 top  (outside the outline)
DD16  99.06,-85.85 270 top  (outside the outline)
DD17  86.36,-85.85 270 top  (outside the outline)
DD18  73.66,-85.85 270 top  (outside the outline)
DD19  269.24,-151.89 180 top  (outside the outline)
DD20  121.92,-13.46 0 top  (outside the outline)
DD21  38.1,-160.78 270 top  (outside the outline)
DD22  50.8,-160.78 270 top  (outside the outline)
DD23  63.5,-160.78 270 top  (outside the outline)
DD24  76.2,-160.78 270 top  (outside the outline)
DD25  88.9,-160.78 270 top  (outside the outline)
DD26  101.6,-160.78 270 top  (outside the outline)
DD27  114.3,-160.78 270 top  (outside the outline)
DD28  127,-160.78 270 top  (outside the outline)
DD29  95.25,-41.4 270 top  (outside the outline)
DD30  46.99,-38.86 270 top  (outside the outline)
DD31  45.72,-83.31 270 top  (outside the outline)
DD32  20.32,-87.12 270 top  (outside the outline)
DD33  33.02,-87.12 270 top  (outside the outline)
DD34  58.42,-83.31 270 top  (outside the outline)
DD36  71.12,-12.19 180 top  (outside the outline)
DD37  220.98,-143 90 top  (outside the outline)
DD38  223.52,-108.71 90 top  (outside the outline)
DD39  243.84,-143 270 top  (outside the outline)
DD40  147.32,-23.62 0 top  (outside the outline)
DD45  203.2,-68.07 90 top  (outside the outline)
DD102  25.4,-160.78 270 top  (outside the outline)
DD103  12.7,-160.78 270 top  (outside the outline)
DD104  0,-160.78 270 top  (outside the outline)
DD107  21.59,-71.88 0 top  (outside the outline)
DD108  5.08,-61.72 270 top  (outside the outline)
DD109  7.62,-87.12 90 top  (outside the outline)
DD110  5.08,-37.59 270 top  (outside the outline)
DD112  24.13,-38.86 270 top  (outside the outline)
DD113  46.99,-57.91 270 top  (outside the outline)
DD114  25.4,-43.94 90 top  (outside the outline)
DD3011.1  38.1,-40.13 270 top  (outside the outline)
DD3011.2  53.34,-40.13 270 top  (outside the outline)
J1  -22.86,-13.46 180 top  (outside the outline)
JP1  190.5,55.12 180 top  (outside the outline)
JP2  58.42,-176.02 0 top  (outside the outline)
JP3  59.69,-145.54 0 top  (outside the outline)
KB  71.12,13.21 0 top  (outside the outline)
LED1  -17.78,27.18 0 top  (outside the outline)
R1  142.24,10.67 180 bottom  (outside the outline)
R2  151.13,9.4 180 bottom  (outside the outline)
R3  189.23,3.05 90 bottom  (outside the outline)
R4  186.69,-14.73 90 bottom  (outside the outline)
R5  191.77,-5.84 90 bottom  (outside the outline)
R6  144.78,-125.22 270 top  (outside the outline)
R9  245.11,-187.45 270 bottom  (outside the outline)
R10  205.74,-5.84 0 bottom  (outside the outline)
R11  205.74,6.86 0 bottom  (outside the outline)
R13  161.29,10.67 180 top  (outside the outline)
R14  97.79,-65.53 0 bottom  (outside the outline)
R23  96.52,-57.91 180 top  (outside the outline)
R47  157.48,-125.22 270 top  (outside the outline)
R48  151.13,-125.22 270 top  (outside the outline)
R101  5.08,-17.27 90 top  (outside the outline)
R102  6.35,-24.89 90 top  (outside the outline)
R103  5.08,-10.92 90 top  (outside the outline)
R105  179.07,-178.56 0 bottom  (outside the outline)
R106  180.34,-179.83 0 bottom  (outside the outline)
R107  -17.78,18.29 90 bottom  (outside the outline)
RD1  140.97,-38.86 90 bottom  (outside the outline)
RD2  161.29,-3.3 180 top  (outside the outline)
U$2  -41.91,-21.08 0 top  (outside the outline)
VD1  133.35,-120.14 270 top  (outside the outline)
VD2  128.27,-120.14 270 top  (outside the outline)
VD3  123.19,-120.14 270 top  (outside the outline)
VD3*  118.11,-120.14 270 top  (outside the outline)
VD4  224.79,-187.45 270 bottom  (outside the outline)
VD5  229.87,-187.45 270 bottom  (outside the outline)
VD6  234.95,-187.45 270 bottom  (outside the outline)
VD7  240.03,-187.45 270 bottom  (outside the outline)
VD8  198.12,-123.95 90 top  (outside the outline)
VD9  158.75,-66.8 270 bottom  (outside the outline)
VD10  157.48,-75.69 270 bottom  (outside the outline)
X1  27.94,1.78 180 top
Z1  148.59,13.21 0 top  (outside the outline)

### Tracks (layer width: path | path; a pad name or v marks a point on that pad's centre or on a via)
!CAS  (1 unrouted)
  Bottom 0.406: DD28.15 129.54,-154.43 127,-153.16 121.92,-153.16 DD27.15 116.84,-154.43 114.3,-153.16 109.22,-153.16 DD26.15 104.14,-154.43 101.6,-153.16 96.52,-153.16 DD25.15 91.44,-154.43 88.9,-153.16 83.82,-153.16 DD24.15 78.74,-154.43 76.2,-153.16 71.12,-153.16 DD23.15 66.04,-154.43 63.5,-153.16 58.42,-153.16 DD22.15 53.34,-154.43 50.8,-153.16 45.72,-153.16 DD21.15 40.64,-154.43 38.1,-153.16 33.02,-153.16 DD102.15 27.94,-154.43 25.4,-153.16 20.32,-153.16 DD103.15 15.24,-154.43 12.7,-153.16 7.62,-153.16 DD104.15
!G19A  (2 unrouted)
!G19B  (1 unrouted)
!RAS  (2 unrouted)
  Bottom 0.406: DD28.4 119.38,-160.78 116.84,-160.78 114.3,-159.51 DD27.4 106.68,-160.78 104.14,-160.78 101.6,-159.51 DD26.4 93.98,-160.78 91.44,-160.78 88.9,-159.51 DD25.4 81.28,-160.78 78.74,-160.78 76.2,-159.51 DD24.4 68.58,-160.78 66.04,-160.78 63.5,-159.51 DD23.4 55.88,-160.78 53.34,-160.78 50.8,-159.51 DD22.4 43.18,-160.78 40.64,-160.78 38.1,-159.51 DD21.4 30.48,-160.78 27.94,-160.78 25.4,-159.51 DD102.4 17.78,-160.78 15.24,-160.78 12.7,-159.51 DD103.4 5.08,-160.78 2.54,-160.78 0,-159.51 DD104.4
!RD  (5 unrouted)
!RESIN  (1 unrouted)
!U7  (2 unrouted)
!WE  (1 unrouted)
  Bottom 0.406: DD28.3 119.38,-158.24 116.84,-158.24 114.3,-156.97 DD27.3 106.68,-158.24 104.14,-158.24 101.6,-156.97 DD26.3 93.98,-158.24 91.44,-158.24 88.9,-156.97 DD25.3 81.28,-158.24 78.74,-158.24 76.2,-156.97 DD24.3 68.58,-158.24 66.04,-158.24 63.5,-156.97 DD23.3 55.88,-158.24 53.34,-158.24 50.8,-156.97 DD22.3 43.18,-158.24 40.64,-158.24 38.1,-156.97 DD21.3 30.48,-158.24 27.94,-158.24 25.4,-156.97 DD102.3 17.78,-158.24 15.24,-158.24 12.7,-156.97 DD103.3 5.08,-158.24 2.54,-158.24 0,-156.97 DD104.3
!WR  (4 unrouted)
+5V  (46 unrouted)
  Bottom 0.406: RD1.2 DD2.16
  Bottom 1.27: DD18.16 77.47,-74.42 | DD17.16 90.17,-74.42 | DD16.16 102.87,-74.42 | DD15.16 115.57,-74.42
  Bottom 1.422: DD21.8 34.29,-172.21 | DD22.8 46.99,-172.21 | DD23.8 59.69,-172.21 | DD24.8 72.39,-172.21 | DD25.8 85.09,-172.21 | DD26.8 97.79,-172.21 | DD27.8 110.49,-172.21 | 123.19,-172.21 DD28.8 | DD104.8 -3.81,-172.21 | DD103.8 8.89,-172.21 | DD102.8 20.32,-172.21
  Bottom 1.93: 123.19,-172.21 110.49,-172.21 97.79,-172.21 85.09,-172.21 72.39,-172.21 59.69,-172.21 46.99,-172.21 34.29,-172.21 20.32,-172.21 8.89,-172.21 -3.81,-172.21 | 69.85,-74.42 77.47,-74.42 90.17,-74.42 102.87,-74.42 115.57,-74.42
+12V  (4 unrouted)
-5V  (5 unrouted)
A0  (4 unrouted)
A1  (4 unrouted)
A2  (1 unrouted)
A3  (1 unrouted)
A4  (1 unrouted)
A5  (1 unrouted)
A6  (1 unrouted)
A7  (1 unrouted)
A8  (1 unrouted)
A9  (1 unrouted)
A10  (1 unrouted)
A11  (1 unrouted)
A12  (1 unrouted)
A13  (2 unrouted)
A14  (1 unrouted)
A15  (1 unrouted)
B  (1 unrouted)
  Bottom 0.406: DD104.2 0,-154.43
B0  (1 unrouted)
  Top 0.406: 2.54,-149.35 1.27,-150.62 1.27,-155.7 2.54,-156.97 DD104.14
CLK  (3 unrouted)
CRG  (2 unrouted)
D0  (4 unrouted)
D1  (4 unrouted)
D2  (4 unrouted)
D3  (4 unrouted)
D4  (4 unrouted)
D5  (4 unrouted)
D6  (4 unrouted)
D7  (4 unrouted)
DD9DD14  (3 unrouted)
F1  (2 unrouted)
F2  (2 unrouted)
G  (1 unrouted)
G0  (1 unrouted)
  Top 0.406: 12.7,-155.7 13.97,-156.97 DD103.14
G1  (1 unrouted)
G2  (1 unrouted)
G3  (2 unrouted)
G4  (2 unrouted)
G5  (5 unrouted)
G6  (2 unrouted)
G7  (2 unrouted)
G8  (2 unrouted)
G9  (3 unrouted)
G10  (4 unrouted)
G11  (4 unrouted)
G12  (3 unrouted)
G13  (2 unrouted)
G14  (2 unrouted)
G15  (4 unrouted)
G16  (6 unrouted)
G17  (2 unrouted)
G18  (6 unrouted)
G19  (3 unrouted)
  Bottom 0.406: DD18.2 73.66,-79.5 74.93,-80.77 80.01,-80.77 81.28,-79.5 DD17.2 86.36,-79.5 87.63,-80.77 92.71,-80.77 93.98,-79.5 DD16.2 99.06,-79.5 100.33,-80.77 105.41,-80.77 106.68,-79.5 DD15.2
GND  (77 unrouted)
  Bottom 0.406: DD18.1 73.66,-76.96 76.2,-79.5 DD18.15 78.74,-79.5 81.28,-76.96 DD17.1 86.36,-76.96 88.9,-79.5 DD17.15 91.44,-79.5 93.98,-76.96 DD16.1 99.06,-76.96 101.6,-79.5 DD16.15 104.14,-79.5 106.68,-76.96 DD15.1 111.76,-76.96 114.3,-79.5 DD15.15 | DD18.12 78.74,-87.12 80.01,-88.39 80.01,-93.47 81.28,-94.74 DD17.8
  Bottom 1.27: DD21.16 41.91,-149.35 | DD22.16 54.61,-149.35 | DD23.16 67.31,-149.35 | DD24.16 80.01,-149.35 | DD28.16 130.81,-149.35 | DD27.16 118.11,-149.35 | DD26.16 105.41,-149.35 | DD25.16 92.71,-149.35 | DD15.8 107.95,-97.28 | DD16.8 95.25,-97.28 | DD17.8 82.55,-97.28 | DD18.8 69.85,-97.28 | 1.27,-149.35 3.81,-149.35
  Bottom 1.422: DD104.16 3.81,-149.35 | DD102.16 29.21,-149.35 | DD103.16 16.51,-149.35
  Bottom 1.93: 130.81,-149.35 118.11,-149.35 105.41,-149.35 92.71,-149.35 80.01,-149.35 67.31,-149.35 54.61,-149.35 41.91,-149.35 29.21,-149.35 16.51,-149.35 3.81,-149.35 | 116.84,-97.28 107.95,-97.28 95.25,-97.28 82.55,-97.28 69.85,-97.28 67.31,-97.28
K1  (2 unrouted)
K2  (2 unrouted)
K3  (2 unrouted)
K4  (2 unrouted)
K5  (2 unrouted)
K6  (3 unrouted)
K7  (1 unrouted)
K8  (2 unrouted)
K9  (2 unrouted)
K10  (2 unrouted)
K11  (2 unrouted)
K12  (2 unrouted)
K13  (2 unrouted)
K14  (2 unrouted)
K15  (2 unrouted)
K16  (2 unrouted)
K17  (2 unrouted)
K18  (2 unrouted)
K19  (2 unrouted)
K20  (2 unrouted)
K27  (1 unrouted)
LED  (1 unrouted)
MA0
  Top 0.406: DD15.7 113.03,-92.2 114.3,-93.47 109.22,-148.08 113.03,-151.89 113.03,-160.78 111.76,-162.05 DD27.5
  Bottom 0.406: DD28.5 119.38,-163.32 116.84,-163.32 114.3,-162.05 DD27.5 106.68,-163.32 104.14,-163.32 101.6,-162.05 DD26.5 93.98,-163.32 91.44,-163.32 88.9,-162.05 DD25.5 81.28,-163.32 78.74,-163.32 76.2,-162.05 DD24.5 68.58,-163.32 66.04,-163.32 63.5,-162.05 DD23.5 55.88,-163.32 53.34,-163.32 50.8,-162.05 DD22.5 43.18,-163.32 40.64,-163.32 38.1,-162.05 DD21.5 30.48,-163.32 27.94,-163.32 25.4,-162.05 DD102.5 17.78,-163.32 15.24,-163.32 12.7,-162.05 DD103.5 5.08,-163.32 2.54,-163.32 0,-162.05 DD104.5
MA1
  Top 0.406: DD15.9 107.95,-167.13 DD27.7
  Bottom 0.406: DD28.7 119.38,-168.4 116.84,-168.4 114.3,-167.13 DD27.7 106.68,-168.4 104.14,-168.4 101.6,-167.13 DD26.7 93.98,-168.4 91.44,-168.4 88.9,-167.13 DD25.7 81.28,-168.4 78.74,-168.4 76.2,-167.13 DD24.7 68.58,-168.4 66.04,-168.4 63.5,-167.13 DD23.7 55.88,-168.4 53.34,-168.4 50.8,-167.13 DD22.7 43.18,-168.4 40.64,-168.4 38.1,-167.13 DD21.7 30.48,-168.4 27.94,-168.4 25.4,-167.13 DD102.7 17.78,-168.4 15.24,-168.4 12.7,-167.13 DD103.7 5.08,-168.4 2.54,-168.4 0,-167.13 DD104.7
MA2  (1 unrouted)
  Top 0.406: DD16.7 100.33,-92.2 101.6,-90.93 111.76,-149.35 114.3,-151.89 114.3,-164.59
  Bottom 0.406: DD28.6 119.38,-165.86 116.84,-165.86 114.3,-164.59 DD27.6 106.68,-165.86 104.14,-165.86 101.6,-164.59 DD26.6 93.98,-165.86 91.44,-165.86 88.9,-164.59 DD25.6 81.28,-165.86 78.74,-165.86 76.2,-164.59 DD24.6 68.58,-165.86 66.04,-165.86 63.5,-164.59 DD23.6 55.88,-165.86 53.34,-165.86 50.8,-164.59 DD22.6 43.18,-165.86 40.64,-165.86 38.1,-164.59 DD21.6 30.48,-165.86 27.94,-165.86 25.4,-164.59 DD102.6 17.78,-165.86 15.24,-165.86 12.7,-164.59 DD103.6 5.08,-165.86 2.54,-165.86 0,-164.59 DD104.6
MA3  (1 unrouted)
  Top 0.406: DD16.9 104.14,-94.74 106.68,-97.28 105.41,-149.35 102.87,-151.89 102.87,-160.27 102.11,-161.04
  Bottom 0.406: DD28.12 129.54,-162.05 127,-160.78 121.92,-160.78 DD27.12 116.84,-162.05 114.3,-160.78 109.22,-160.78 DD26.12 104.14,-162.05 101.6,-160.78 96.52,-160.78 DD25.12 91.44,-162.05 88.9,-160.78 83.82,-160.78 DD24.12 78.74,-162.05 76.2,-160.78 71.12,-160.78 DD23.12 66.04,-162.05 63.5,-160.78 58.42,-160.78 DD22.12 53.34,-162.05 50.8,-160.78 45.72,-160.78 DD21.12 40.64,-162.05 38.1,-160.78 33.02,-160.78 DD102.12 27.94,-162.05 25.4,-160.78 20.32,-160.78 DD103.12 15.24,-162.05 12.7,-160.78 7.62,-160.78 DD104.12
MA4  (1 unrouted)
  Top 0.406: DD17.7 87.63,-92.2 88.9,-90.93 99.06,-90.93 101.6,-88.39 114.3,-150.62 115.57,-151.89 115.57,-163.32
  Bottom 0.406: DD28.11 129.54,-164.59 127,-163.32 121.92,-163.32 DD27.11 116.84,-164.59 114.3,-163.32 109.22,-163.32 DD26.11 104.14,-164.59 101.6,-163.32 96.52,-163.32 DD25.11 91.44,-164.59 88.9,-163.32 83.82,-163.32 DD24.11 78.74,-164.59 76.2,-163.32 71.12,-163.32 DD23.11 66.04,-164.59 63.5,-163.32 58.42,-163.32 DD22.11 53.34,-164.59 50.8,-163.32 45.72,-163.32 DD21.11 40.64,-164.59 38.1,-163.32 33.02,-163.32 DD102.11 27.94,-164.59 25.4,-163.32 20.32,-163.32 DD103.11 15.24,-164.59 12.7,-163.32 7.62,-163.32 DD104.11
MA5  (1 unrouted)
  Top 0.406: DD17.9 92.71,-94.74 96.52,-98.55 104.14,-149.35 100.33,-153.16 100.33,-165.86
  Bottom 0.406: DD28.10 129.54,-167.13 127,-165.86 121.92,-165.86 DD27.10 116.84,-167.13 114.3,-165.86 109.22,-165.86 DD26.10 104.14,-167.13 101.6,-165.86 96.52,-165.86 DD25.10 91.44,-167.13 88.9,-165.86 83.82,-165.86 DD24.10 78.74,-167.13 76.2,-165.86 71.12,-165.86 DD23.10 66.04,-167.13 63.5,-165.86 58.42,-165.86 DD22.10 53.34,-167.13 50.8,-165.86 45.72,-165.86 DD21.10 40.64,-167.13 38.1,-165.86 33.02,-165.86 DD102.10 27.94,-167.13 25.4,-165.86 20.32,-165.86 DD103.10 15.24,-167.13 12.7,-165.86 7.62,-165.86 DD104.10
MA6  (1 unrouted)
  Top 0.406: DD18.7 73.66,-92.2 74.93,-90.93 74.93,-87.12 76.2,-85.85 119.38,-71.88 120.65,-150.62 120.65,-156.97
  Bottom 0.406: DD28.13 129.54,-159.51 127,-158.24 121.92,-158.24 DD27.13 116.84,-159.51 114.3,-158.24 109.22,-158.24 DD26.13 104.14,-159.51 101.6,-158.24 96.52,-158.24 DD25.13 91.44,-159.51 88.9,-158.24 83.82,-158.24 DD24.13 78.74,-159.51 76.2,-158.24 71.12,-158.24 DD23.13 66.04,-159.51 63.5,-158.24 58.42,-158.24 DD22.13 53.34,-159.51 50.8,-158.24 45.72,-158.24 DD21.13 40.64,-159.51 38.1,-158.24 33.02,-158.24 DD102.13 27.94,-159.51 25.4,-158.24 20.32,-158.24 DD103.13 15.24,-159.51 12.7,-158.24 7.62,-158.24 DD104.13
MA7  (1 unrouted)
  Top 0.406: DD18.9 80.01,-94.74 105.41,-33.78 105.41,-69.34 95.25,-151.89 95.25,-169.67
  Bottom 0.406: DD28.9 129.54,-169.67 127,-168.4 121.92,-168.4 DD27.9 116.84,-169.67 114.3,-168.4 109.22,-168.4 DD26.9 104.14,-169.67 101.6,-168.4 96.52,-168.4 DD25.9 91.44,-169.67 88.9,-168.4 83.82,-168.4 DD24.9 78.74,-169.67 76.2,-168.4 71.12,-168.4 DD23.9 66.04,-169.67 63.5,-168.4 58.42,-168.4 DD22.9 50.8,-168.4 45.72,-168.4 DD21.9 40.64,-169.67 38.1,-168.4 33.02,-168.4 DD102.9 27.94,-169.67 25.4,-168.4 20.32,-168.4 DD103.9 15.24,-169.67 12.7,-168.4 7.62,-168.4 DD104.9
MD0  (2 unrouted)
  Bottom 0.406: DD21.2 DD21.14
MD1  (2 unrouted)
  Bottom 0.406: DD22.2 DD22.14
MD2  (2 unrouted)
  Bottom 0.406: DD23.2 DD23.14
MD3  (2 unrouted)
  Bottom 0.406: DD24.2 DD24.14
MD4  (2 unrouted)
  Bottom 0.406: DD25.2 DD25.14
MD5  (2 unrouted)
  Bottom 0.406: DD26.2 DD26.14
MD6  (2 unrouted)
  Bottom 0.406: DD27.2 DD27.14
MD7  (2 unrouted)
  Bottom 0.406: DD28.2 DD28.14
N$1  (1 unrouted)
N$2  (2 unrouted)
N$3  (2 unrouted)
N$4  (1 unrouted)
N$5  (2 unrouted)
N$6  (3 unrouted)
N$7  (2 unrouted)
N$8  (2 unrouted)
N$9  (1 unrouted)
N$10  (1 unrouted)
N$11  (1 unrouted)
N$12  (1 unrouted)
N$13  (1 unrouted)
N$14  (1 unrouted)
N$15  (1 unrouted)
N$16  (2 unrouted)
N$17  (1 unrouted)
N$18  (4 unrouted)
N$19  (2 unrouted)
N$20  (1 unrouted)
N$21  (2 unrouted)
N$22  (2 unrouted)
N$23  (1 unrouted)
N$24  (1 unrouted)
N$25  (1 unrouted)
N$26  (2 unrouted)
N$27  (4 unrouted)
N$28  (1 unrouted)
N$29  (1 unrouted)
  Bottom 0.406: 143.51,-37.59 143.51,-40.13 141.1,-40.13 RD1.1 | 143.51,-37.59 DD2.15 | DD2.9 158.75,-37.59 156.21,-37.59 | 156.21,-37.59 DD2.10 | DD2.11 153.67,-37.59 | 153.67,-37.59 156.21,-37.59 | 153.67,-37.59 143.51,-37.59 | 140.97,-40.13 RD1.1 | RD1.1 DD2.1
N$31  (5 unrouted)
N$32  (1 unrouted)
N$33  (2 unrouted)
N$34  (1 unrouted)
N$35  (2 unrouted)
N$36  (1 unrouted)
N$37  (1 unrouted)
N$38  (6 unrouted)
N$39  (2 unrouted)
N$40  (2 unrouted)
N$41  (3 unrouted)
N$42  (3 unrouted)
N$43  (1 unrouted)
N$44  (1 unrouted)
N$45  (1 unrouted)
N$46  (1 unrouted)
N$48  (1 unrouted)
N$49  (2 unrouted)
N$50  (1 unrouted)
N$51  (1 unrouted)
N$52  (1 unrouted)
N$53  (2 unrouted)
N$54  (1 unrouted)
N$55  (1 unrouted)
N$56  (1 unrouted)
N$57  (1 unrouted)
N$65  (1 unrouted)
N$66  (1 unrouted)
N$69  (1 unrouted)
P16  (1 unrouted)
P17  (1 unrouted)
P18  (1 unrouted)
P19  (1 unrouted)
P20  (1 unrouted)
P21  (1 unrouted)
P22  (1 unrouted)
P23  (1 unrouted)
P24  (1 unrouted)
Q3  (3 unrouted)
R  (1 unrouted)
R0  (1 unrouted)
  Top 0.406: 15.24,-148.08 16.51,-149.35 22.86,-149.35 26.67,-153.16 26.67,-155.7 27.94,-156.97 DD102.14
R2  (1 unrouted)
RD  (2 unrouted)
RES  (2 unrouted)
RES80  (1 unrouted)
SNY  (1 unrouted)
U7  (1 unrouted)
VCC  (6 unrouted)
VD0  (1 unrouted)
VD1  (1 unrouted)
VD2  (1 unrouted)
VD3  (1 unrouted)
VD4  (1 unrouted)
VD5  (1 unrouted)
VD6  (1 unrouted)
VD7  (1 unrouted)
VID  (6 unrouted)
  Bottom 0.406: -15.24,-50.29 -15.24,-113.79 189.23,-113.79 189.23,-28.7
(copper drawn outside any net)
  shapes: Top area x2

### Text on the board
bPlace: 220х135 вост экс нов | 21x13